# EAGLE design PSPS_AVNC_SRD_power-2021-02-03 (EAGLE 9.6.2)
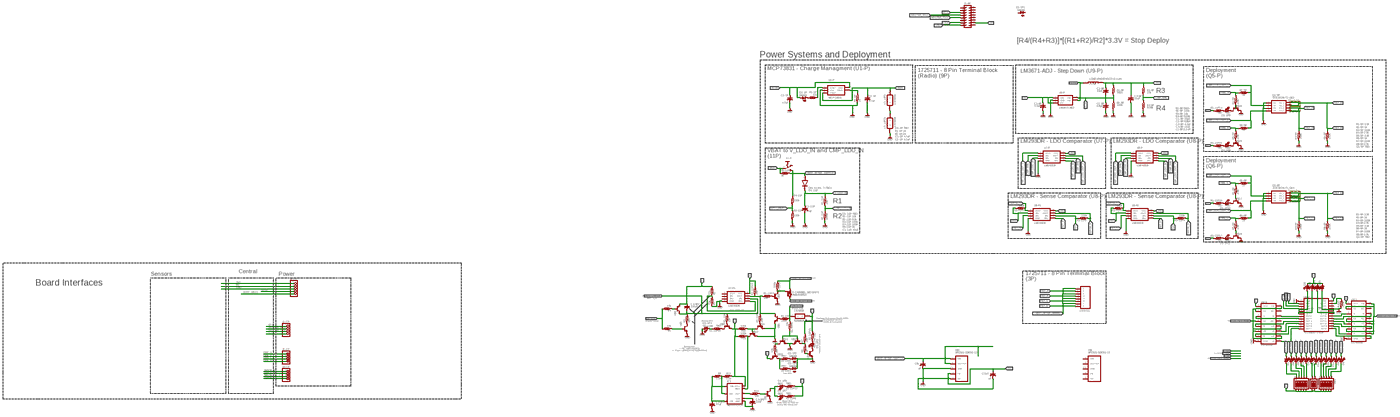
[diagram p0: schematic, sheet 1, overview]
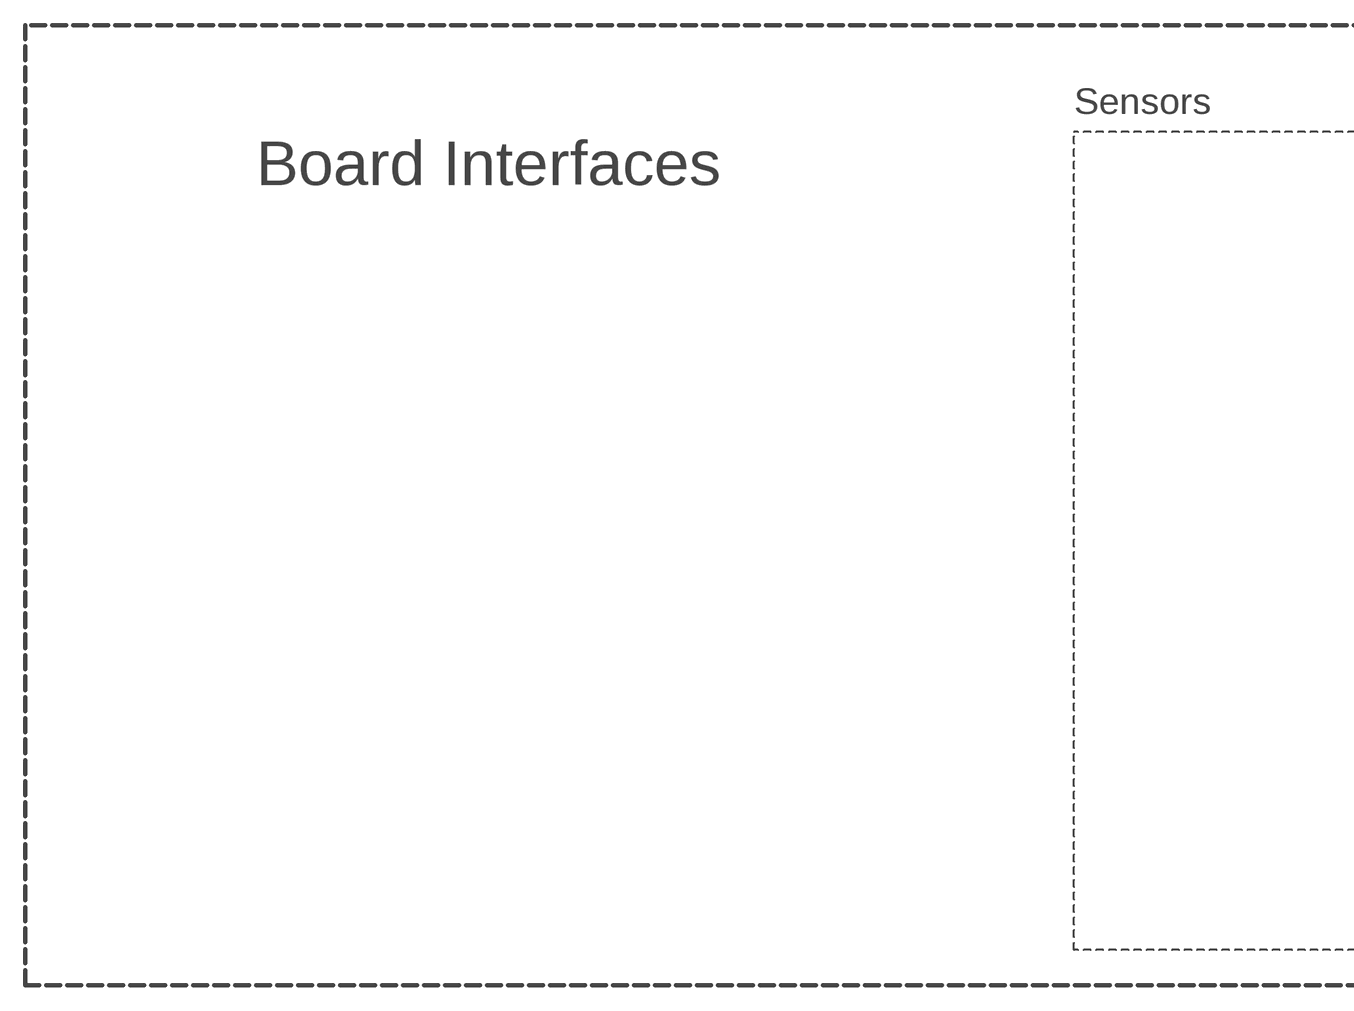
[diagram p1: schematic, sheet 1, part 1 of 4]
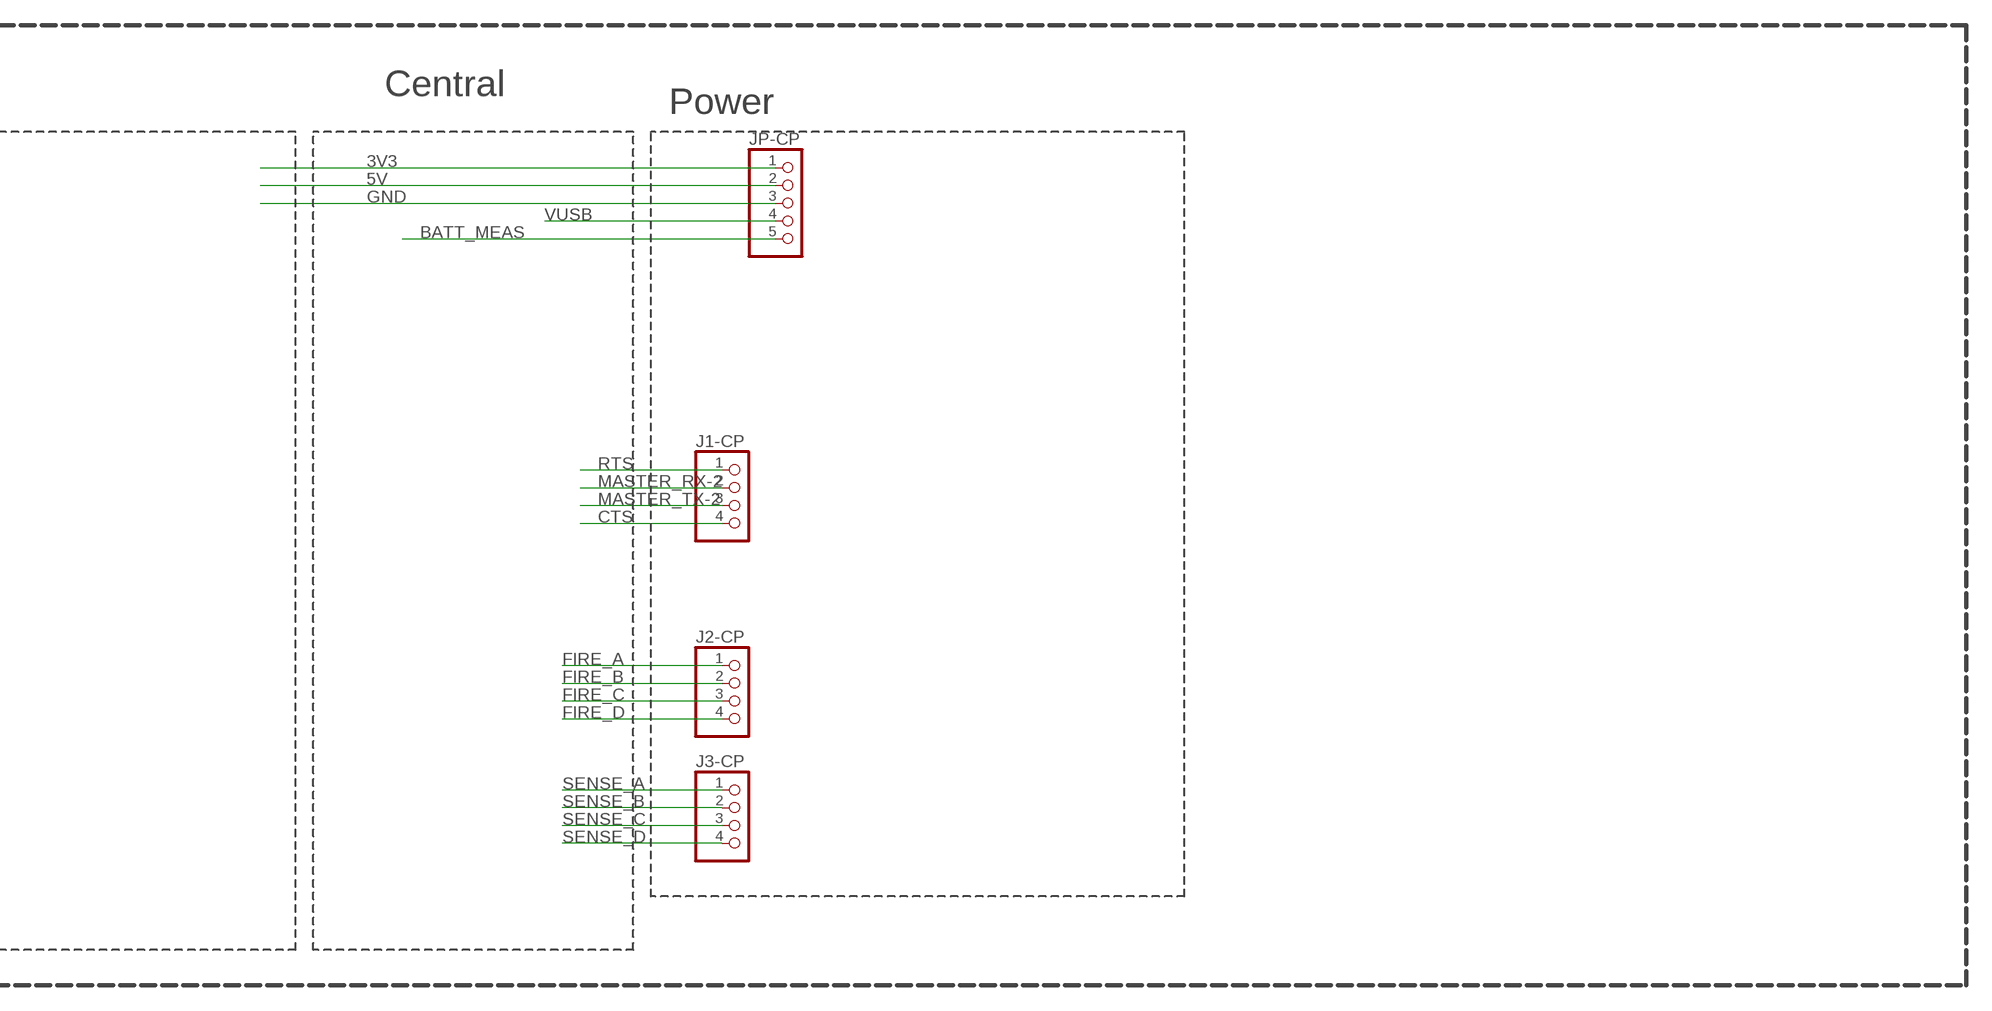
[diagram p2: schematic, sheet 1, part 2 of 4]
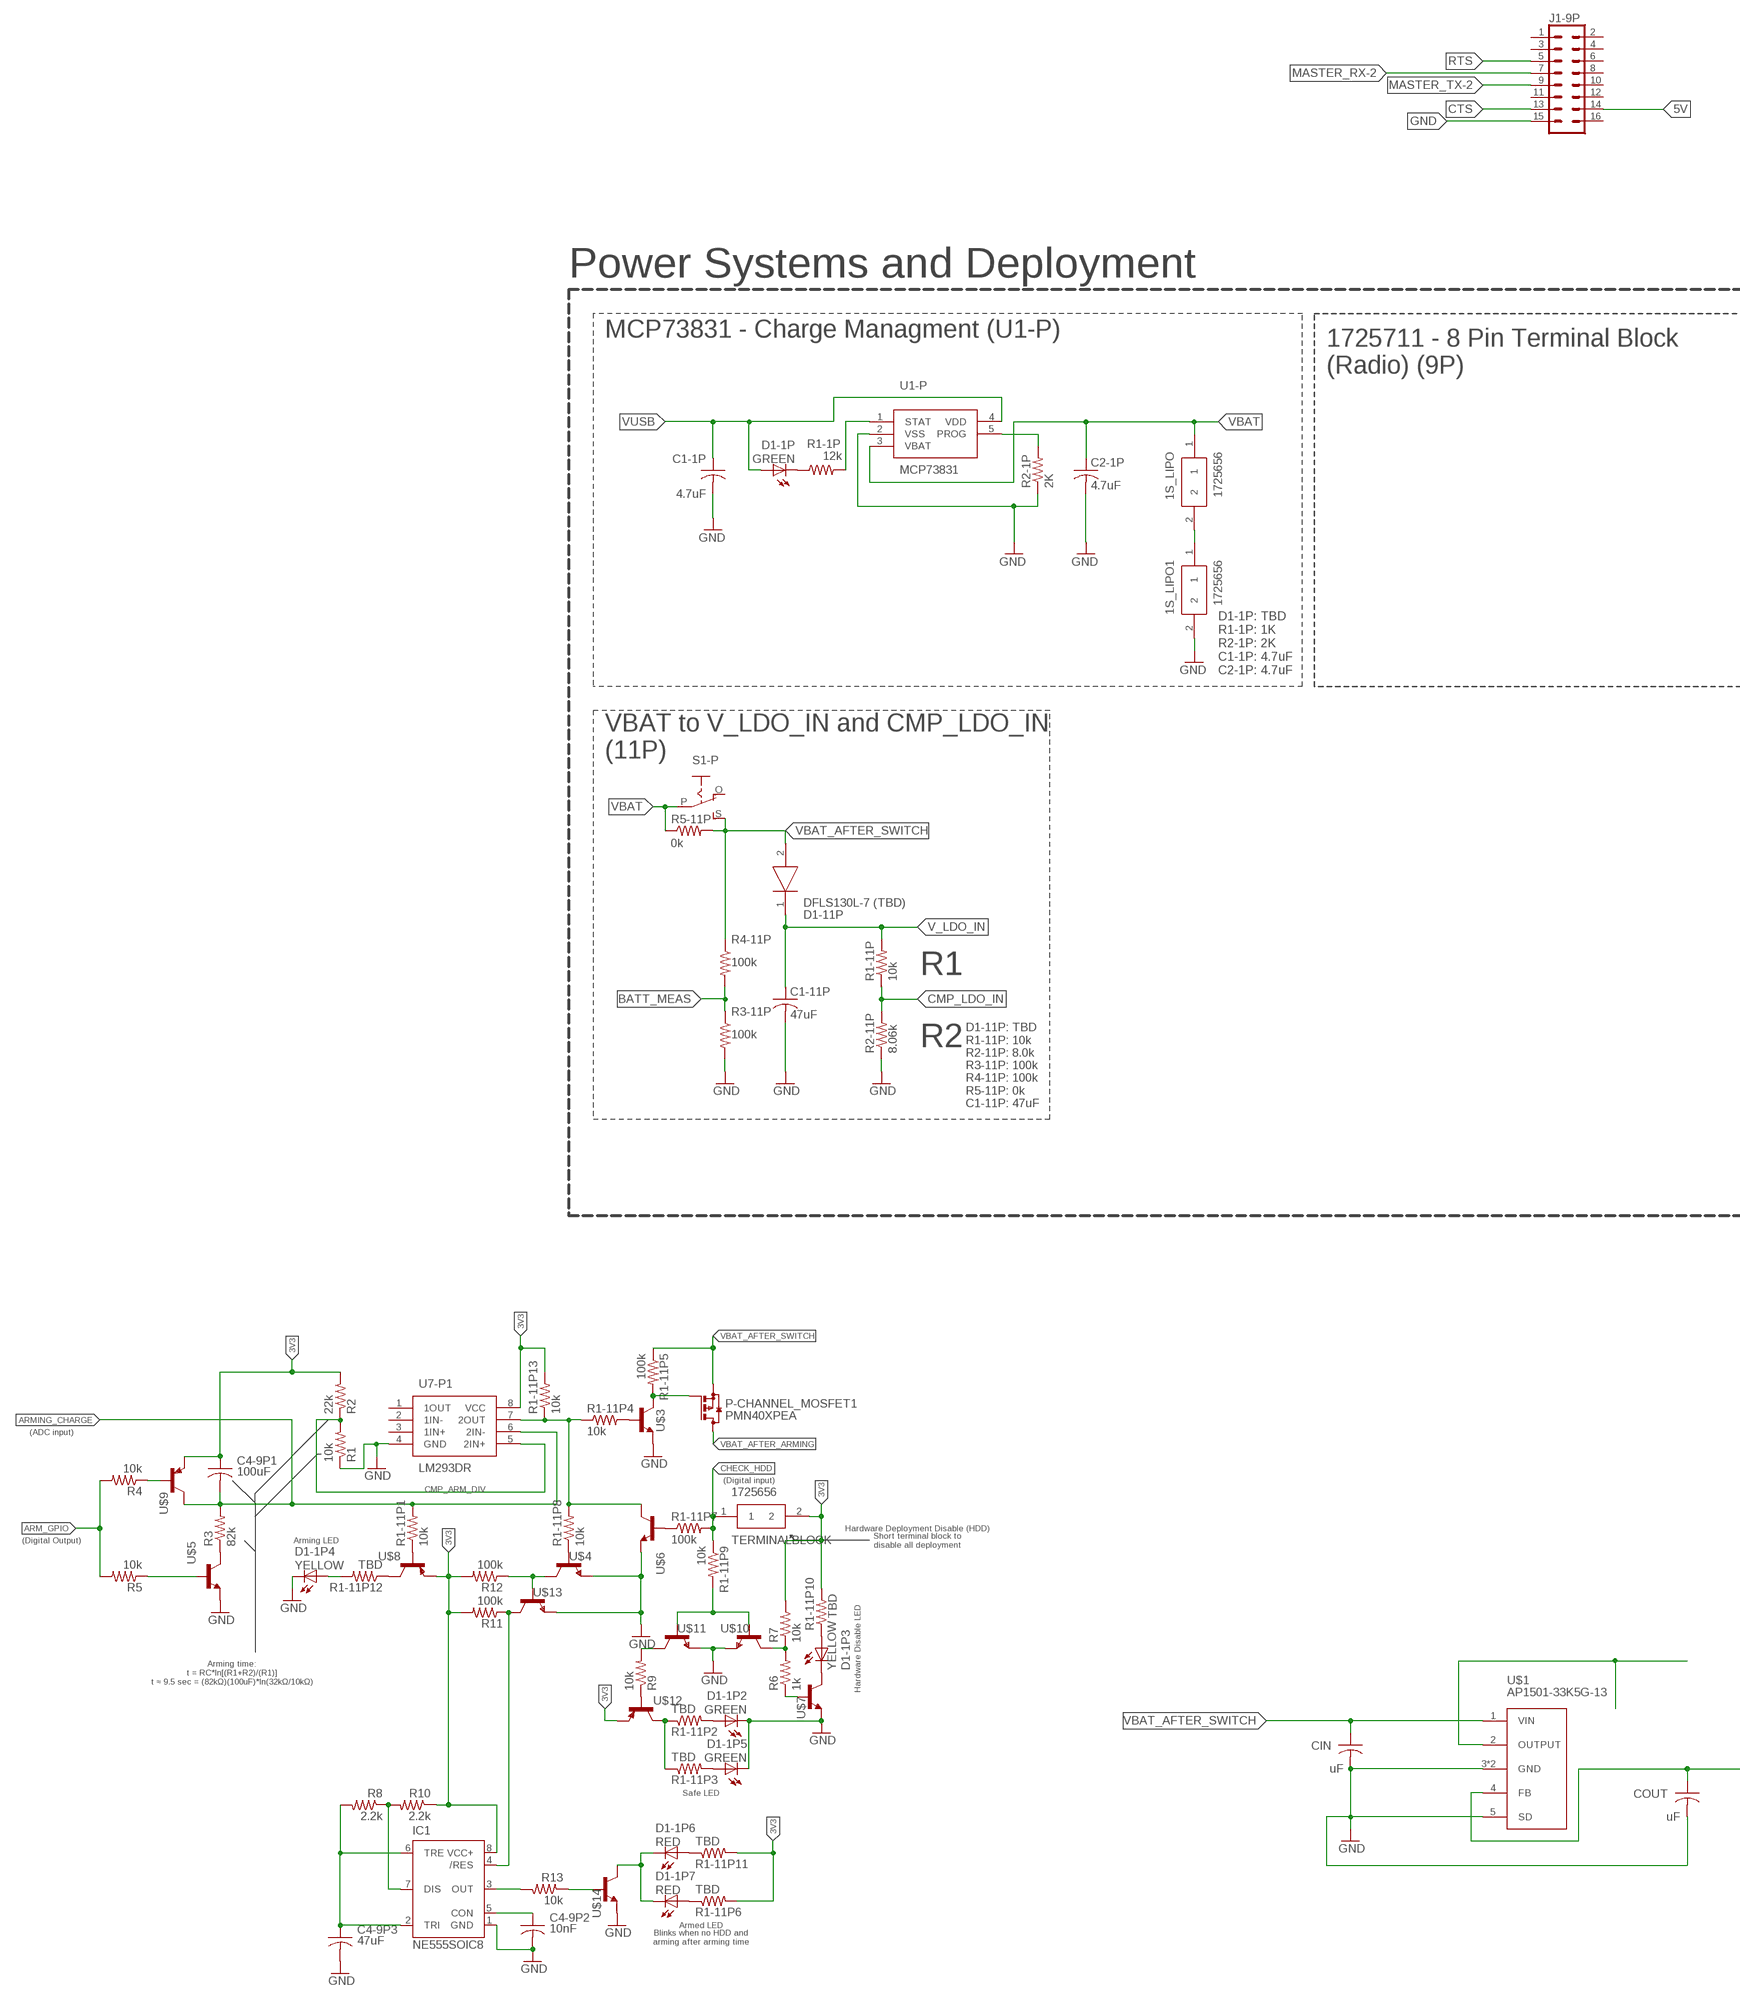
[diagram p3: schematic, sheet 1, part 3 of 4]
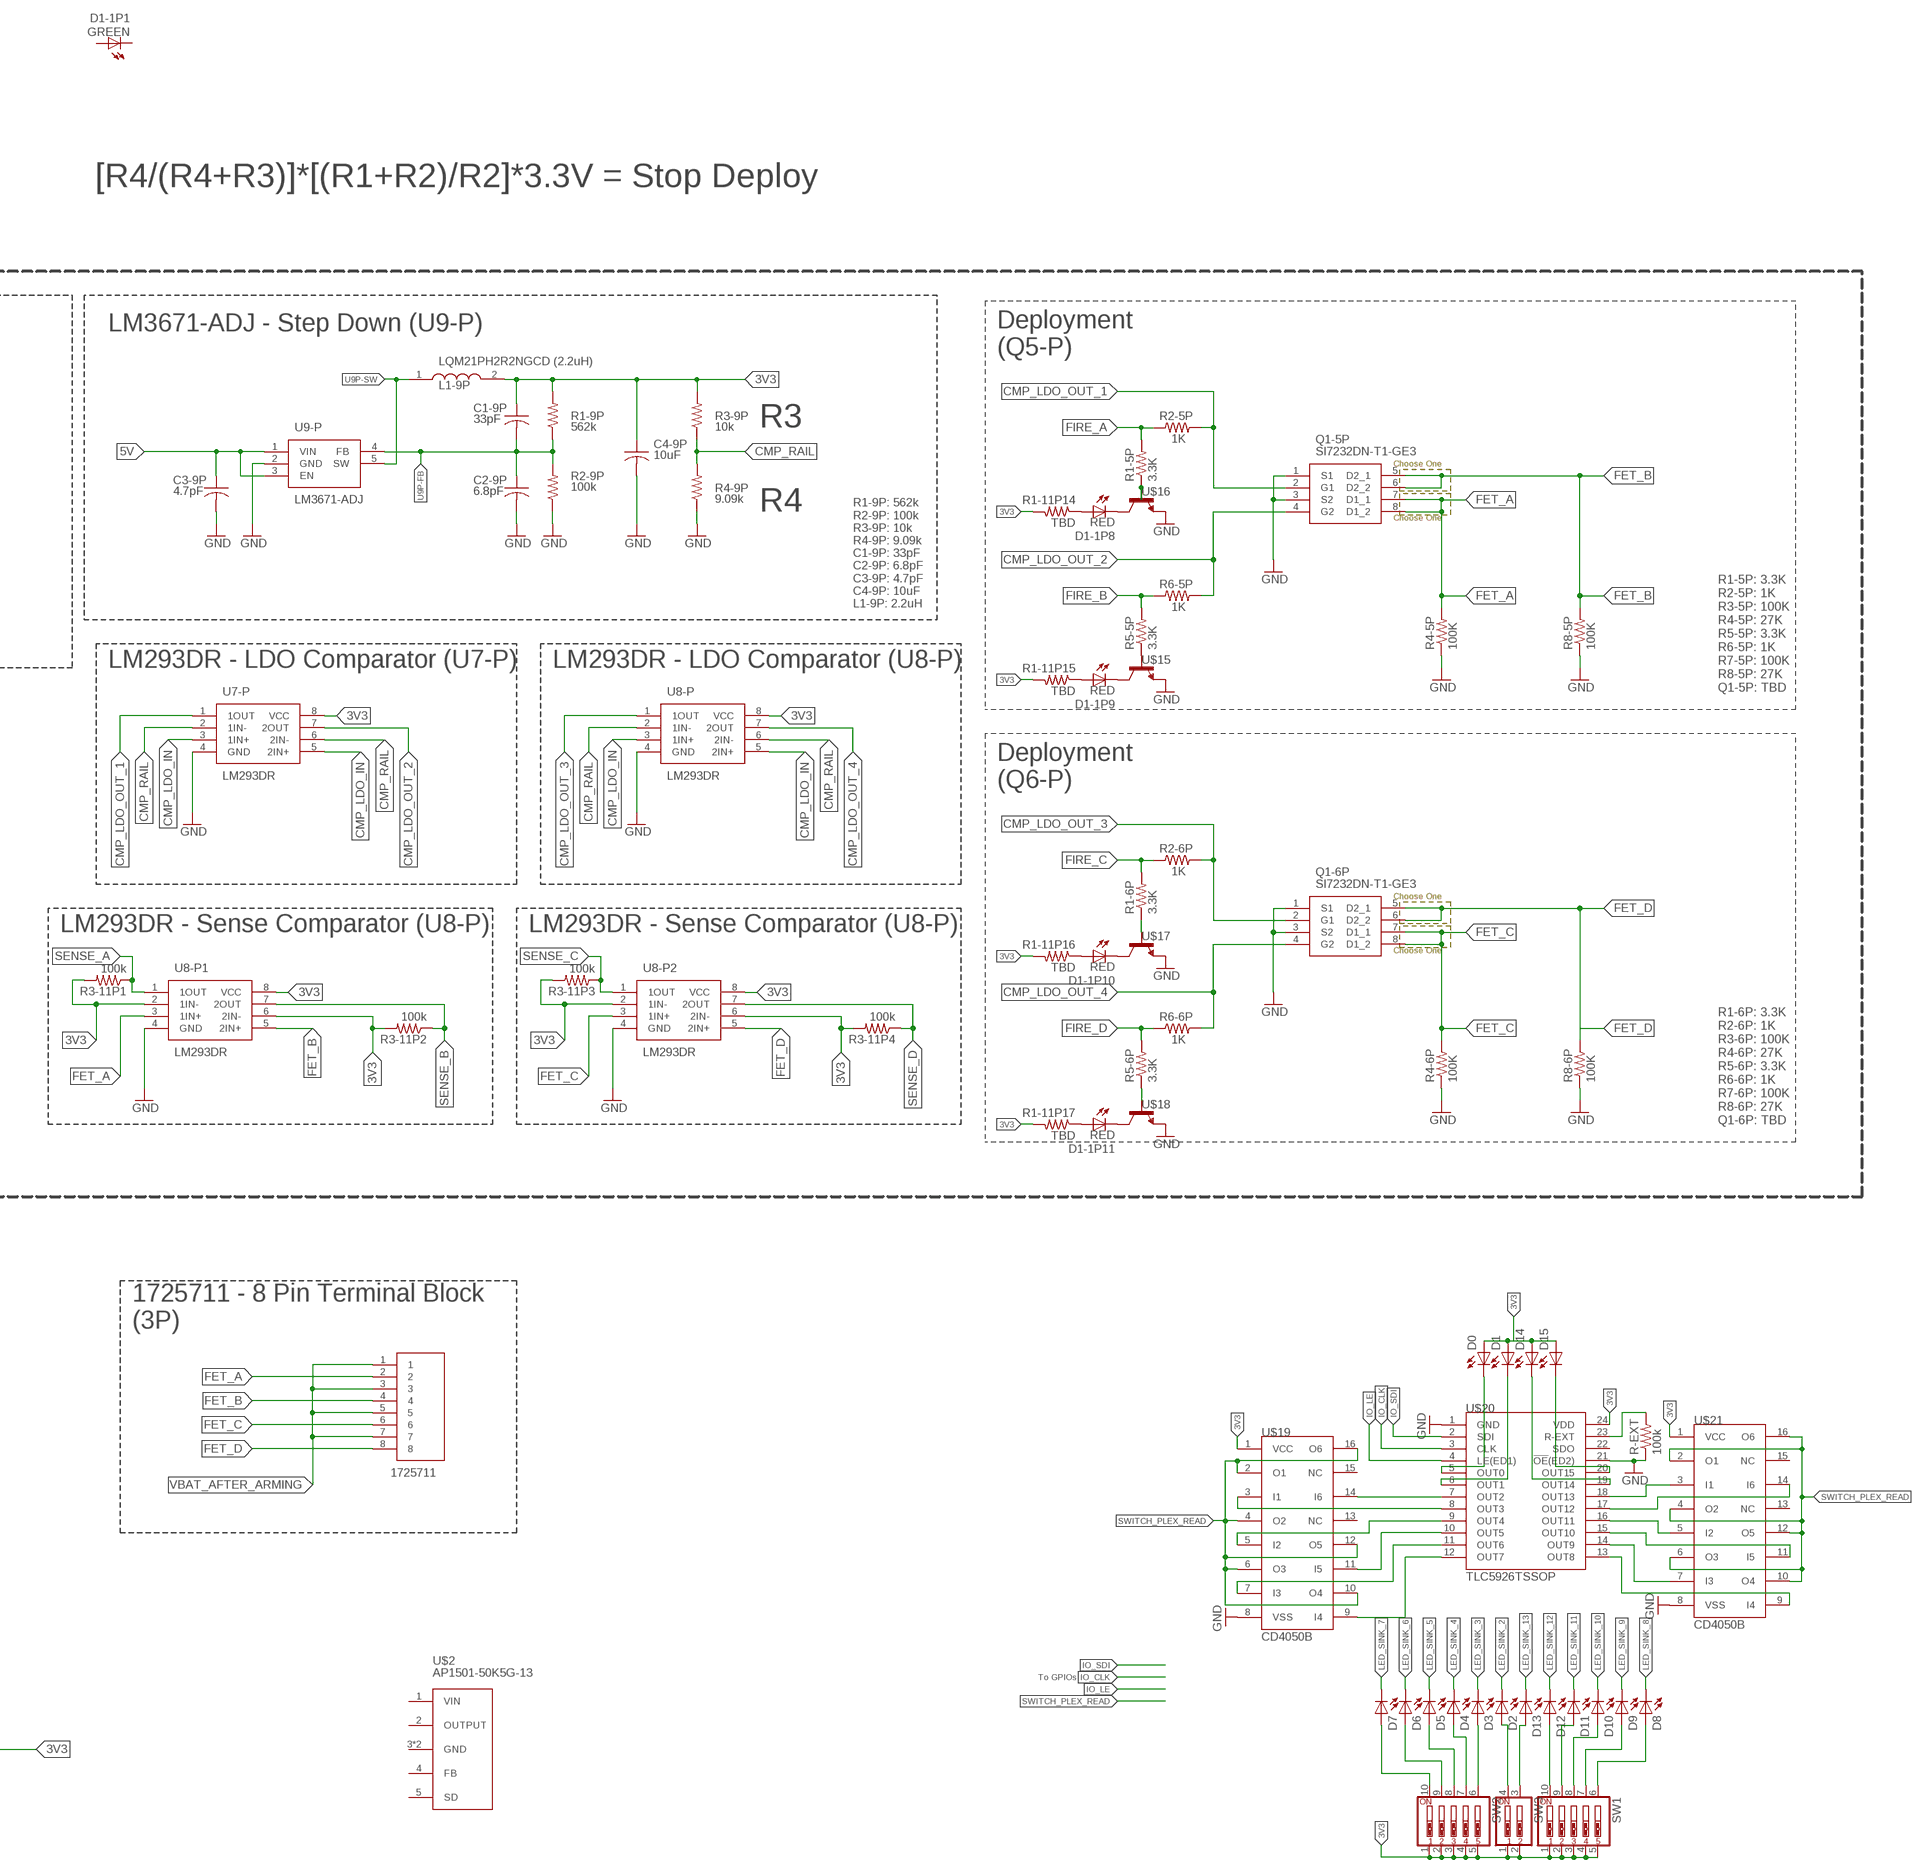
[diagram p4: schematic, sheet 1, part 4 of 4]

## Parts
1S_LIPO  1725656  [1725656]
1S_LIPO1  1725656  [1725656]
C1-1P  4.7uF  C-USC0805  [C0805]
C1-9P  33pF  C-USC0805  [C0805]
C1-11P  47uF  C-USC0805  [C0805]
C2-1P  4.7uF  C-USC0805  [C0805]
C2-9P  6.8pF  C-USC0805  [C0805]
C3-9P  4.7pF  C-USC0805  [C0805]
C4-9P  10uF  C-USC0805  [C0805]
C4-9P1  100uF  C-USC0805  [C0805]
C4-9P2  10nF  C-USC0805  [C0805]
C4-9P3  47uF  C-USC0805  [C0805]
CIN  uF  C-USC0805  [C0805]
COUT  uF  C-USC0805  [C0805]
D0  LEDCHIPLED_0805  [CHIPLED_0805]
D1  LEDCHIPLED_0805  [CHIPLED_0805]
D1-1P  GREEN  LEDCHIPLED_0805  [CHIPLED_0805]
D1-1P1  GREEN  LEDCHIPLED_0805  [CHIPLED_0805]
D1-1P2  GREEN  LEDCHIPLED_0805  [CHIPLED_0805]
D1-1P3  YELLOW  LEDCHIPLED_0805  [CHIPLED_0805]
D1-1P4  YELLOW  LEDCHIPLED_0805  [CHIPLED_0805]
D1-1P5  GREEN  LEDCHIPLED_0805  [CHIPLED_0805]
D1-1P6  RED  LEDCHIPLED_0805  [CHIPLED_0805]
D1-1P7  RED  LEDCHIPLED_0805  [CHIPLED_0805]
D1-1P8  RED  LEDCHIPLED_0805  [CHIPLED_0805]
D1-1P9  RED  LEDCHIPLED_0805  [CHIPLED_0805]
D1-1P10  RED  LEDCHIPLED_0805  [CHIPLED_0805]
D1-1P11  RED  LEDCHIPLED_0805  [CHIPLED_0805]
D1-11P  DFLS130L-7 (TBD)  DFLS130L-7  [POWERDI_123]
D2  LEDCHIPLED_0805  [CHIPLED_0805]
D3  LEDCHIPLED_0805  [CHIPLED_0805]
D4  LEDCHIPLED_0805  [CHIPLED_0805]
D5  LEDCHIPLED_0805  [CHIPLED_0805]
D6  LEDCHIPLED_0805  [CHIPLED_0805]
D7  LEDCHIPLED_0805  [CHIPLED_0805]
D8  LEDCHIPLED_0805  [CHIPLED_0805]
D9  LEDCHIPLED_0805  [CHIPLED_0805]
D10  LEDCHIPLED_0805  [CHIPLED_0805]
D11  LEDCHIPLED_0805  [CHIPLED_0805]
D12  LEDCHIPLED_0805  [CHIPLED_0805]
D13  LEDCHIPLED_0805  [CHIPLED_0805]
D14  LEDCHIPLED_0805  [CHIPLED_0805]
D15  LEDCHIPLED_0805  [CHIPLED_0805]
IC1  NE555SOIC8  [SOIC127P599X175-8]
J1-9P  CONN_08X2  [2X8]
J1-CP  PINHD-1X4  [1X04]
J2-CP  PINHD-1X4  [1X04]
J2-P  1725711  [1725711]
J3-CP  PINHD-1X4  [1X04]
JP-CP  PINHD-1X5  [1X05]
L1-9P  LQM21PH2R2NGCD (2.2uH)  LQM21PH2R2NGCD  [INDC2012X100N]
P-CHANNEL_MOSFET1  PMN40XPEA  [PMN40XPEA]
Q1-5P  SI7232DN-T1-GE3  [POWERPAK-1212-8]
Q1-6P  SI7232DN-T1-GE3  [POWERPAK-1212-8]
R1  10k  R-US_R0805  [R0805]
R1-1P  12k  R-US_R0805  [R0805]
R1-5P  3.3K  R-US_M0805  [M0805]
R1-6P  3.3K  R-US_M0805  [M0805]
R1-9P  562k  R-US_R0805  [R0805]
R1-11P  10k  R-US_R0805  [R0805]
R1-11P1  10k  R-US_R0805  [R0805]
R1-11P2  TBD  R-US_R0805  [R0805]
R1-11P3  TBD  R-US_R0805  [R0805]
R1-11P4  10k  R-US_R0805  [R0805]
R1-11P5  100k  R-US_R0805  [R0805]
R1-11P6  TBD  R-US_R0805  [R0805]
R1-11P7  100k  R-US_R0805  [R0805]
R1-11P8  10k  R-US_R0805  [R0805]
R1-11P9  10k  R-US_R0805  [R0805]
R1-11P10  TBD  R-US_R0805  [R0805]
R1-11P11  TBD  R-US_R0805  [R0805]
R1-11P12  TBD  R-US_R0805  [R0805]
R1-11P13  10k  R-US_R0805  [R0805]
R1-11P14  TBD  R-US_R0805  [R0805]
R1-11P15  TBD  R-US_R0805  [R0805]
R1-11P16  TBD  R-US_R0805  [R0805]
R1-11P17  TBD  R-US_R0805  [R0805]
R2  22k  R-US_R0805  [R0805]
R2-1P  2K  R-US_R0805  [R0805]
R2-5P  1K  R-US_M0805  [M0805]
R2-6P  1K  R-US_M0805  [M0805]
R2-9P  100k  R-US_R0805  [R0805]
R2-11P  8.06k  R-US_R0805  [R0805]
R3  82k  R-US_R0805  [R0805]
R3-9P  10k  R-US_R0805  [R0805]
R3-11P  100k  R-US_R0805  [R0805]
R3-11P1  100k  R-US_R0805  [R0805]
R3-11P2  100k  R-US_R0805  [R0805]
R3-11P3  100k  R-US_R0805  [R0805]
R3-11P4  100k  R-US_R0805  [R0805]
R4  10k  R-US_R0805  [R0805]
R4-5P  100K  R-US_M0805  [M0805]
R4-6P  100K  R-US_M0805  [M0805]
R4-9P  9.09k  R-US_R0805  [R0805]
R4-11P  100k  R-US_R0805  [R0805]
R5  10k  R-US_R0805  [R0805]
R5-5P  3.3K  R-US_M0805  [M0805]
R5-6P  3.3K  R-US_M0805  [M0805]
R5-11P  0k  R-US_R0805  [R0805]
R6  1k  R-US_R0805  [R0805]
R6-5P  1K  R-US_M0805  [M0805]
R6-6P  1K  R-US_M0805  [M0805]
R7  10k  R-US_R0805  [R0805]
R8  2.2k  R-US_R0805  [R0805]
R8-5P  100K  R-US_M0805  [M0805]
R8-6P  100K  R-US_M0805  [M0805]
R9  10k  R-US_R0805  [R0805]
R10  2.2k  R-US_R0805  [R0805]
R11  100k  R-US_R0805  [R0805]
R12  100k  R-US_R0805  [R0805]
R13  10k  R-US_R0805  [R0805]
R-EXT  100k  R-US_R0805  [R0805]
S1-P  EG1218S  [EG1218]
SW1  SW_DIP-5  [EDG-05]
SW2  SW_DIP-5  [EDG-05]
SW3  SW_DIP-2  [EDG-02]
TERMINALBLOCK  1725656  [1725656]
U1-P  MCP73831  MCP73831T-2ACI_OT  [SOT95P270X145-5N]
U7-P  LM293DR  [SOIC127P600X175-8N]
U7-P1  LM293DR  [SOIC127P600X175-8N]
U8-P  LM293DR  [SOIC127P600X175-8N]
U8-P1  LM293DR  [SOIC127P600X175-8N]
U8-P2  LM293DR  [SOIC127P600X175-8N]
U9-P  LM3671-ADJ  LM3671MFX-ADJ_NOPB  [SOT95P280X145-5N]
U$1  AP1501-33K5G-13  AP1501-33K5G-13TO263-5L  [TO185P1524X485-6N]
U$2  AP1501-50K5G-13  AP1501-33K5G-13TO263-5L  [TO185P1524X485-6N]
U$3  NPN_TRANSISTOR  [SOT23]
U$4  NPN_TRANSISTOR  [SOT23]
U$5  NPN_TRANSISTOR  [SOT23]
U$6  NPN_TRANSISTOR  [SOT23]
U$7  NPN_TRANSISTOR  [SOT23]
U$8  PNP_TRANSISTOR  [SOT23]
U$9  PNP_TRANSISTOR  [SOT23]
U$10  NPN_TRANSISTOR  [SOT23]
U$11  NPN_TRANSISTOR  [SOT23]
U$12  PNP_TRANSISTOR  [SOT23]
U$13  NPN_TRANSISTOR  [SOT23]
U$14  NPN_TRANSISTOR  [SOT23]
U$15  NPN_TRANSISTOR  [SOT23]
U$16  NPN_TRANSISTOR  [SOT23]
U$17  NPN_TRANSISTOR  [SOT23]
U$18  NPN_TRANSISTOR  [SOT23]
U$19  CD4050B  [SOIC127P600X175-16N]
U$20  TLC5926TSSOP  [SOP65P640X120-24N]
U$21  CD4050B  [SOIC127P600X175-16N]

## Nets
3V3: C1-9P.1 C4-9P1.1 C4-9P.1 COUT.1 D0.A D1.A D14.A D15.A IC1.8(VCC+) JP-CP.1 L1-9P.2 R1-9P.2 R1-11P6.2 R1-11P10.2 R1-11P11.2 R1-11P13.2 R1-11P14.2 R1-11P15.2 R1-11P16.2 R1-11P17.2 R2.2 R3-9P.2 R3-11P1.2 R3-11P2.2 R3-11P3.2 R3-11P4.2 R7.2 R10.1 R11.2 R12.2 SW1.1 SW1.2 SW1.3 SW1.4 SW1.5 SW2.1 SW2.2 SW2.3 SW2.4 SW2.5 SW3.1 SW3.2 TERMINALBLOCK.2 U7-P1.8(VCC) U7-P.8(VCC) U8-P1.2(1IN-) U8-P1.6(2IN-) U8-P1.8(VCC) U8-P2.2(1IN-) U8-P2.6(2IN-) U8-P2.8(VCC) U8-P.8(VCC) U$1.4(FB) U$8.2(E) U$9.2(E) U$12.2(E) U$19.1(VCC) U$20.24(VDD) U$21.1(VCC)
5V: C3-9P.1 J1-9P.14 JP-CP.2 U9-P.1(VIN) U9-P.3(EN)
ARM_GPIO: R4.2 R5.2
ARMING_CHARGE: C4-9P1.2 R1-11P1.2 R3.2 U7-P1.6(2IN-) U$9.3(C)
BATT_MEAS: JP-CP.5 R3-11P.1 R4-11P.2
CHECK_HDD: R1-11P7.2 R1-11P9.1 TERMINALBLOCK.1
CMP_ARM_DIV: R1.2 R2.1 U7-P1.5(2IN+)
CMP_LDO_IN: R1-11P.1 R2-11P.2 U7-P.3(1IN+) U7-P.5(2IN+) U8-P.3(1IN+) U8-P.5(2IN+)
CMP_LDO_OUT_1: Q1-5P.2(G1) R2-5P.2 U7-P.1(1OUT)
CMP_LDO_OUT_2: Q1-5P.4(G2) R6-5P.2 U7-P.7(2OUT)
CMP_LDO_OUT_3: Q1-6P.2(G1) R2-6P.2 U8-P.1(1OUT)
CMP_LDO_OUT_4: Q1-6P.4(G2) R6-6P.2 U8-P.7(2OUT)
CMP_RAIL: R3-9P.1 R4-9P.2 U7-P.2(1IN-) U7-P.6(2IN-) U8-P.2(1IN-) U8-P.6(2IN-)
CTS: J1-9P.13 J1-CP.4
D1-1P_R1-1P: D1-1P.C R1-1P.1
FET_A: J2-P.2 Q1-5P.7(D1_1) Q1-5P.8(D1_2) R4-5P.2 U8-P1.3(1IN+)
FET_B: J2-P.4 Q1-5P.5(D2_1) Q1-5P.6(D2_2) R8-5P.2 U8-P1.5(2IN+)
FET_C: J2-P.6 Q1-6P.7(D1_1) Q1-6P.8(D1_2) R4-6P.2 U8-P2.3(1IN+)
FET_D: J2-P.8 Q1-6P.5(D2_1) Q1-6P.6(D2_2) R8-6P.2 U8-P2.5(2IN+)
FIRE_A: J2-CP.1 R1-5P.2 R2-5P.1
FIRE_B: J2-CP.2 R5-5P.2 R6-5P.1
FIRE_C: J2-CP.3 R1-6P.2 R2-6P.1
FIRE_D: J2-CP.4 R5-6P.2 R6-6P.1
GND: 1S_LIPO1.2 C1-1P.2 C1-11P.2 C2-1P.2 C2-9P.2 C3-9P.2 C4-9P2.2 C4-9P3.2 C4-9P.2 CIN.2 COUT.2 D1-1P2.C D1-1P4.C D1-1P5.C IC1.1(GND) J1-9P.15 JP-CP.3 Q1-5P.1(S1) Q1-5P.3(S2) Q1-6P.1(S1) Q1-6P.3(S2) R1.1 R2-1P.1 R2-9P.1 R2-11P.1 R3-11P.2 R4-5P.1 R4-6P.1 R4-9P.1 R8-5P.1 R8-6P.1 R-EXT.1 U1-P.2(VSS) U7-P1.4(GND) U7-P.4(GND) U8-P1.4(GND) U8-P2.4(GND) U8-P.4(GND) U9-P.2(GND) U$1.3(GND) U$1.5(SD) U$1.6(GND) U$3.3(E) U$4.3(E) U$5.3(E) U$6.3(E) U$7.3(E) U$10.3(E) U$11.3(E) U$13.3(E) U$14.3(E) U$15.3(E) U$16.3(E) U$17.3(E) U$18.3(E) U$19.8(VSS) U$20.1(GND) U$20.21(!OE!(ED2)) U$21.8(VSS)
IO_CLK: U$20.3(CLK)
IO_LE: U$20.4(LE(ED1))
IO_SDI: U$20.2(SDI)
LED_SINK_0: D0.C U$20.5(OUT0)
LED_SINK_1: D1.C U$20.6(OUT1)
LED_SINK_2: D2.C U$19.14(I6) U$20.7(OUT2)
LED_SINK_3: D3.C U$19.3(I1) U$20.8(OUT3)
LED_SINK_4: D4.C U$19.5(I2) U$20.9(OUT4)
LED_SINK_5: D5.C U$19.11(I5) U$20.10(OUT5)
LED_SINK_6: D6.C U$19.7(I3) U$20.11(OUT6)
LED_SINK_7: D7.C U$19.9(I4) U$20.12(OUT7)
LED_SINK_8: D8.C U$20.13(OUT8) U$21.9(I4)
LED_SINK_9: D9.C U$20.14(OUT9) U$21.7(I3)
LED_SINK_10: D10.C U$20.15(OUT10) U$21.11(I5)
LED_SINK_11: D11.C U$20.16(OUT11) U$21.5(I2)
LED_SINK_12: D12.C U$20.17(OUT12) U$21.14(I6)
LED_SINK_13: D13.C U$20.18(OUT13) U$21.3(I1)
LED_SINK_14: D14.C U$20.19(OUT14)
LED_SINK_15: D15.C U$20.20(OUT15)
MASTER_RX-2: J1-9P.7 J1-CP.2
MASTER_TX-2: J1-9P.9 J1-CP.3
N$7: 1S_LIPO1.1 1S_LIPO.2
N$8: U$1.2(OUTPUT)
N$9: R1-11P8.1 U$4.1(B)
N$10: R1-11P1.1 U$8.1(B)
N$11: D1-1P3.C U$7.2(C)
N$12: R6.2 R7.1 U$10.2(C)
N$13: R6.1 U$7.1(B)
N$14: P-CHANNEL_MOSFET1.3(G) R1-11P5.2 U$3.2(C)
N$15: R1-11P4.2 U$3.1(B)
N$16: R1-11P4.1 R1-11P8.2 R1-11P13.1 U7-P1.7(2OUT) U$6.2(C)
N$17: R5.1 U$5.1(B)
N$18: R1-11P7.1 U$6.1(B)
N$19: R1-11P2.1 R1-11P3.1 U$12.3(C)
N$20: R1-11P9.2 U$10.1(B) U$11.1(B)
N$21: R3.1 U$5.2(C)
N$22: D1-1P2.A R1-11P2.2
N$23: D1-1P3.A R1-11P10.1
N$24: R12.1 U$4.2(C) U$13.1(B)
N$25: D1-1P6.A R1-11P11.1
N$26: R9.1 U$12.1(B)
N$27: R1-11P12.1 U$8.3(C)
N$28: D1-1P4.A R1-11P12.2
N$29: R9.2 U$11.2(C)
N$30: R4.1 U$9.1(B)
N$31: D1-1P5.A R1-11P3.2
N$32: IC1.4(/RES) R11.1 U$13.2(C)
N$33: R13.1 U$14.1(B)
N$34: C4-9P2.1 IC1.5(CON)
N$35: C4-9P3.1 IC1.2(TRI) IC1.6(TRE) R8.2
N$36: IC1.7(DIS) R8.1 R10.2
N$37: IC1.3(OUT) R13.2
N$38: D1-1P7.A R1-11P6.1
N$39: D1-1P6.C D1-1P7.C U$14.2(C)
N$40: R5-5P.1 U$15.1(B)
N$41: D1-1P8.C U$16.2(C)
N$42: D1-1P9.A R1-11P15.1
N$43: D1-1P9.C U$15.2(C)
N$44: D1-1P8.A R1-11P14.1
N$45: R1-5P.1 U$16.1(B)
N$46: R1-6P.1 U$17.1(B)
N$47: R5-6P.1 U$18.1(B)
N$48: D1-1P10.C U$17.2(C)
N$49: D1-1P10.A R1-11P16.1
N$50: D1-1P11.C U$18.2(C)
N$51: D1-1P11.A R1-11P17.1
N$52: D7.A SW2.10
N$53: R-EXT.2 U$20.23(R-EXT)
N$54: D3.A SW2.6
N$55: D4.A SW2.7
N$56: D5.A SW2.8
N$57: D6.A SW2.9
N$58: D2.A SW3.4
N$59: D12.A SW1.10
N$61: D11.A SW1.9
N$62: D10.A SW1.8
N$64: D9.A SW1.7
N$65: D8.A SW1.6
N$66: D13.A SW3.3
RTS: J1-9P.5 J1-CP.1
SENSE_A: J3-CP.1 R3-11P1.1 U8-P1.1(1OUT)
SENSE_B: J3-CP.2 R3-11P2.1 U8-P1.7(2OUT)
SENSE_C: J3-CP.3 R3-11P3.1 U8-P2.1(1OUT)
SENSE_D: J3-CP.4 R3-11P4.1 U8-P2.7(2OUT)
SWITCH_PLEX_READ: U$19.2(O1) U$19.4(O2) U$19.6(O3) U$19.10(O4) U$19.12(O5) U$19.16(O6) U$21.2(O1) U$21.4(O2) U$21.6(O3) U$21.10(O4) U$21.12(O5) U$21.16(O6)
U1P-PROG: R2-1P.2 U1-P.5(PROG)
U1P-STAT: R1-1P.2 U1-P.1(STAT)
U9P-FB: C1-9P.2 C2-9P.1 R1-9P.1 R2-9P.2 U9-P.4(FB)
U9P-SW: L1-9P.1 U9-P.5(SW)
V_LDO_IN: C1-11P.1 D1-11P.1(K) R1-11P.2
VBAT: 1S_LIPO.1 C2-1P.1 R5-11P.1 S1-P.P U1-P.3(VBAT)
VBAT_AFTER_ARMING: J2-P.1 J2-P.3 J2-P.5 J2-P.7 P-CHANNEL_MOSFET1.1(D) P-CHANNEL_MOSFET1.2(D) P-CHANNEL_MOSFET1.5(D) P-CHANNEL_MOSFET1.6(D)
VBAT_AFTER_SWITCH: CIN.1 D1-11P.2(A) P-CHANNEL_MOSFET1.4(S) R1-11P5.1 R4-11P.1 R5-11P.2 S1-P.S U$1.1(VIN)
VUSB: C1-1P.1 D1-1P.A JP-CP.4 U1-P.4(VDD)
Unconnected: D1-1P1.A D1-1P1.C J1-9P.1 J1-9P.2 J1-9P.3 J1-9P.4 J1-9P.6 J1-9P.8 J1-9P.10 J1-9P.11 J1-9P.12 J1-9P.16 S1-P.O U7-P1.1(1OUT) U7-P1.2(1IN-) U7-P1.3(1IN+) U$2.1(VIN) U$2.2(OUTPUT) U$2.3(GND) U$2.4(FB) U$2.5(SD) U$2.6(GND) U$19.13(NC) U$19.15(NC) U$20.22(SDO) U$21.13(NC) U$21.15(NC)

## Notes on the sheet
- [R4/(R4+R3)]*[(R1+R2)/R2]*3.3V = Stop Deploy
- Power Systems and Deployment
- MCP73831 - Charge Managment (U1-P)
- LM3671-ADJ - Step Down (U9-P)
- 1725711 - 8 Pin Terminal Block 
  (Radio) (9P)
- Deployment
  (Q5-P)
- R3
- Choose One
- R4
- Choose One
- R1-9P: 562k
  R2-9P: 100k
  R3-9P: 10k
  R4-9P: 9.09k
  C1-9P: 33pF
  C2-9P: 6.8pF
  C3-9P: 4.7pF
  C4-9P: 10uF
  L1-9P: 2.2uH
- D1-1P: TBD
  R1-1P: 1K
  R2-1P: 2K
  C1-1P: 4.7uF
  C2-1P: 4.7uF
- LM293DR - LDO Comparator (U7-P) | LM293DR - LDO Comparator (U8-P)
- R1-5P: 3.3K
  R2-5P: 1K
  R3-5P: 100K
  R4-5P: 27K
  R5-5P: 3.3K
  R6-5P: 1K
  R7-5P: 100K
  R8-5P: 27K
  Q1-5P: TBD
- VBAT to V_LDO_IN and CMP_LDO_IN
  (11P)
- Deployment
  (Q6-P)
- Choose One
- LM293DR - Sense Comparator (U8-P) | LM293DR - Sense Comparator (U8-P)
- R1
- Choose One
- R2
- D1-11P: TBD
  R1-11P: 10k
  R2-11P: 8.0k
  R3-11P: 100k
  R4-11P: 100k
  R5-11P: 0k
  C1-11P: 47uF
- R1-6P: 3.3K
  R2-6P: 1K
  R3-6P: 100K
  R4-6P: 27K
  R5-6P: 3.3K
  R6-6P: 1K
  R7-6P: 100K
  R8-6P: 27K
  Q1-6P: TBD
- Central
- Sensors | Power
- 1725711 - 8 Pin Terminal Block
  (3P)
- Board Interfaces
- (ADC input)
- (Digital input)
- Hardware Deployment Disable (HDD)
- (Digital Output) | Arming LED
- Short terminal block to
  disable all deployment
- Hardware Disable LED
- Arming time:
  t = RC*ln[(R1+R2)/(R1)]
  t ≈ 9.5 sec = (82kΩ)(100uF)*ln(32kΩ/10kΩ)
- To GPIOs
- Safe LED
- Armed LED
- Blinks when no HDD and
  arming after arming time

## Library data of the parts
1S_LIPO 1S_LIPO1 TERMINALBLOCK = SamacSys_Parts:1725656: 2 way PCB vertical mount terminal,2.54mm 2 way PCB vertical mount terminal,2.54mm Source: Datasheet <https://componentsearchengine.com/Datasheets/1/1725656.pdf>; DESCRIPTION: 2 way PCB vertical mount terminal,2.54mm 2 way PCB vertical mount terminal,2.54mm; HEIGHT: 8mm; MANUFACTURER_NAME: Phoenix Contact; MANUFACTURER_PART_NUMBER: 1725656; MOUSER_PART_NUMBER: 651-1725656; MOUSER_PRICE-STOCK: https://www.mouser.com/Search/Refine.aspx?Keyword=651-1725656
C1-1P C1-9P C1-11P C2-1P C2-9P C3-9P C4-9P C4-9P1-C4-9P3 CIN COUT = resistor:C-US: CAPACITOR, American symbol
D0 D1 D1-1P D1-1P1-D1-1P11 D2-D15 = adafruit:LED: LED OSRAM: - CHIPLED LG R971, LG N971, LY N971, LG Q971, LY Q971, LO R971, LY R971 LH N974, LH R974 LS Q976, LO Q976, LY Q976 LO Q996 - Hyper CHIPLED LW Q18S LB Q993, LB Q99A, LB R99A - SideLED LS A670, LO A670, LY A670, LG A670, LP A670 LB A673, LV A673, LT A673, LW A673 LH A674 LY A675 LS A676, LA A676, LO A676, LY A676, LW A676 LS A679, LY A679, LG A679 - Hyper Micro SIDELED® LS Y876, LA Y876, LO Y876, LY Y876 LT Y87S - SmartLED LW L88C, LW L88S LB L89C, LB L89S, LG L890 LS L89K, LO L89K, LY L89K LS L896, LA L896, LO L896, LY L896 - TOPLED LS T670, LO T670, LY T670, LG T670, LP T670 LSG T670, LSP T670, LSY T670, LOP T670, LYG T670 LG T671, LOG T671, LSG T671 LB T673, LV T673, LT T673, LW T673 LH T674 LS T676, LA T676, LO T676, LY T676, LB T676, LH T676, LSB T676, LW T676 LB T67C, LV T67C, LT T67C, LS T67K, LO T67K, LY T67K, LW E67C LS E67B, LA E67B, LO E67B, LY E67B, LB E67C, LV E67C, LT E67C LW T67C LS T679, LY T679, LG T679 LS T770, LO T770, LY T770, LG T770, LP T770 LB T773, LV T773, LT T773, LW T773 LH T774 LS E675, LA E675, LY E675, LS T675 LS T776, LA T776, LO T776, LY T776, LB T776 LHGB T686 LT T68C, LB T68C - Hyper Mini TOPLED® LB M676 - Mini TOPLED Santana® LG M470 LS M47K, LO M47K, LY M47K Source: http://www.osram.convergy.de/
D1-11P = SamacSys_Parts:DFLS130L-7: 1.0A SURFACE MOUNT SCHOTTKY BARRIER RECTIFIER Source: Datasheet <https://componentsearchengine.com/Datasheets/1/DFLS130L-7.pdf>; DESCRIPTION: 1.0A SURFACE MOUNT SCHOTTKY BARRIER RECTIFIER; HEIGHT: mm; MANUFACTURER_NAME: Diodes Inc.; MANUFACTURER_PART_NUMBER: DFLS130L-7; MOUSER_PART_NUMBER: 621-DFLS130L; MOUSER_PRICE-STOCK: https://www.mouser.com/Search/Refine.aspx?Keyword=621-DFLS130L
IC1 = Flight Computer Parts:NE555: General purpose bipolar Timer
J1-9P = SparkFun-Connectors:CONN_08X2: Multi connection point. Often used as Generic Header-pin footprint for 0.1 inch spaced/style header connections You can populate with any combo of single row headers, but if you'd like an exact match, check this: Header - 2x8 (Male, 0.1") <https://www.sparkfun.com/products/13156> (PRT-13156) On any of the 0.1 inch spaced packages, you can populate with these: Break Away Headers - Straight <https://www.sparkfun.com/products/116> (PRT-00116) Break Away Male Headers - Right Angle <https://www.sparkfun.com/products/553> (PRT-00553) Female Headers <https://www.sparkfun.com/products/115> (PRT-00115) Break Away Headers - Machine Pin <https://www.sparkfun.com/products/117> (PRT-00117) Break Away Female Headers - Swiss Machine Pin <https://www.sparkfun.com/products/743> (PRT-00743)
J1-CP J2-CP J3-CP = pinhead:PINHD-1X4: PIN HEADER
J2-P = SamacSys_Parts:1725711: 8 way PCB vertical mount terminal,2.54mm 8 way PCB vertical mount terminal,2.54mm Source: Datasheet <https://componentsearchengine.com/Datasheets/1/1725711.pdf>; DESCRIPTION: 8 way PCB vertical mount terminal,2.54mm 8 way PCB vertical mount terminal,2.54mm; HEIGHT: mm; MANUFACTURER_NAME: Phoenix Contact; MANUFACTURER_PART_NUMBER: 1725711; MOUSER_PART_NUMBER: 651-1725711; MOUSER_PRICE-STOCK: https://www.mouser.com/Search/Refine.aspx?Keyword=651-1725711
JP-CP = pinhead:PINHD-1X5: PIN HEADER
L1-9P = SamacSys_Parts:LQM21PH2R2NGCD: LQM21PH_GC Series Inductor 2.2uH +/-30% 0805 (2012) Source: Datasheet <https://componentsearchengine.com/Datasheets/1/LQM21PH2R2NGCD.pdf>; DESCRIPTION: LQM21PH_GC Series Inductor 2.2uH +/-30% 0805 (2012); HEIGHT: 1mm; MANUFACTURER_NAME: Murata Electronics; MANUFACTURER_PART_NUMBER: LQM21PH2R2NGCD; MOUSER_PART_NUMBER: 81-LQM21PH2R2NGCD; MOUSER_PRICE-STOCK: https://www.mouser.com/Search/Refine.aspx?Keyword=81-LQM21PH2R2NGCD
P-CHANNEL_MOSFET1 = SamacSys_Parts:PMN40XPEA: https://www.mouser.com/datasheet/2/916/PMN40XPEA-1880110.pdf
Q1-5P Q1-6P = SamacSys_Parts:SI7232DN-T1-GE3: Trans MOSFET N-CH 20V 10An Vishay SI7232DN-T1-GE3 Dual N-channel MOSFET Transistor, 24 A, 20 V, 8-Pin PowerPAK 1212 Source: Datasheet <http://www.mouser.com/ds/2/427/si7232dn-279732.pdf>; ARROW_PART_NUMBER: SI7232DN-T1-GE3; ARROW_PRICE-STOCK: https://www.arrow.com/en/products/si7232dn-t1-ge3/vishay; DESCRIPTION: Trans MOSFET N-CH 20V 10An Vishay SI7232DN-T1-GE3 Dual N-channel MOSFET Transistor, 24 A, 20 V, 8-Pin PowerPAK 1212; HEIGHT: mm; MANUFACTURER_NAME: Vishay; MANUFACTURER_PART_NUMBER: SI7232DN-T1-GE3; MOUSER_PART_NUMBER: 781-SI7232DN-GE3; MOUSER_PRICE-STOCK: https://www.mouser.co.uk/ProductDetail/Vishay-Semiconductors/SI7232DN-T1-GE3?qs=%252BPu8jn5UVnH5FJ8Jo4EbFw%3D%3D
R1 R1-1P R1-9P R1-11P R1-11P1-R1-11P17 R2 R2-1P R2-9P R2-11P R3 R3-9P R4 R4-9P R5-R13 = resistor:R-US_: RESISTOR, American symbol
R1-5P R1-6P R2-5P R2-6P R4-5P R4-6P R5-5P R5-6P R6-5P R6-6P R8-5P R8-6P = rcl:R-US_: RESISTOR, American symbol; SPICEPREFIX: R
R3-11P R3-11P1-R3-11P4 R4-11P R5-11P R-EXT = PulseOximeterECG_AU:R-US_: RESISTOR, American symbol; SPICEPREFIX: R
S1-P = adafruit:EG1218: SLIDING SWITCH 0.1" spacing through hole, vertical SPDT slide switch http://www.ladyada.net/library/pcb/eaglelibrary.html
SW1 SW2 = special:SW_DIP-5: DIP SWITCH
SW3 = special:SW_DIP-2: DIP SWITCH
U1-P = SamacSys_Parts:MCP73831T-2ACI_OT: Li-Ion Charge Controller 4.2V SOT23-5 Source: Datasheet <http://ww1.microchip.com/downloads/en/DeviceDoc/20001984g.pdf>; DESCRIPTION: Li-Ion Charge Controller 4.2V SOT23-5; HEIGHT: 1.45mm; MANUFACTURER_NAME: Microchip; MANUFACTURER_PART_NUMBER: MCP73831T-2ACI/OT; MOUSER_PART_NUMBER: 579-MCP73831T-2ACIOT; MOUSER_PRICE-STOCK: https://www.mouser.co.uk/ProductDetail/Microchip-Technology/MCP73831T-2ACI-OT?qs=yUQqVecv4qvbBQBGbHx0Mw%3D%3D
U7-P U7-P1 U8-P U8-P1 U8-P2 = SamacSys_Parts:LM293DR: Dual differential comparator, industrial grade Source: Datasheet <http://www.ti.com/lit/gpn/lm293>; DESCRIPTION: Dual differential comparator, industrial grade; HEIGHT: 1.75mm; MANUFACTURER_NAME: Texas Instruments; MANUFACTURER_PART_NUMBER: LM293DR; MOUSER_PART_NUMBER: 595-LM293DR; MOUSER_PRICE-STOCK: https://www.mouser.com/Search/Refine.aspx?Keyword=595-LM293DR
U9-P = SamacSys_Parts:LM3671MFX-ADJ_NOPB: 2MHz, 600mA Step-Down DC-DC Converter Source: Datasheet <http://www.ti.com/lit/gpn/lm3671>; DESCRIPTION: 2MHz, 600mA Step-Down DC-DC Converter; HEIGHT: 1.45mm; MANUFACTURER_NAME: Texas Instruments; MANUFACTURER_PART_NUMBER: LM3671MFX-ADJ/NOPB; MOUSER_PART_NUMBER: 926-LM3671MFXADJNOPB; MOUSER_PRICE-STOCK: https://www.mouser.com/Search/Refine.aspx?Keyword=926-LM3671MFXADJNOPB
U$1 U$2 = SamacSys_Parts:AP1501-33K5G-13
U$3-U$7 U$10 U$11 U$13-U$18 = Flight Computer Parts:NPN_TRANSISTOR
U$8 U$9 U$12 = Flight Computer Parts:PNP_TRANSISTOR
U$19 U$21 = Computer2:CD4050B
U$20 = Custom:TLC5926

## Board
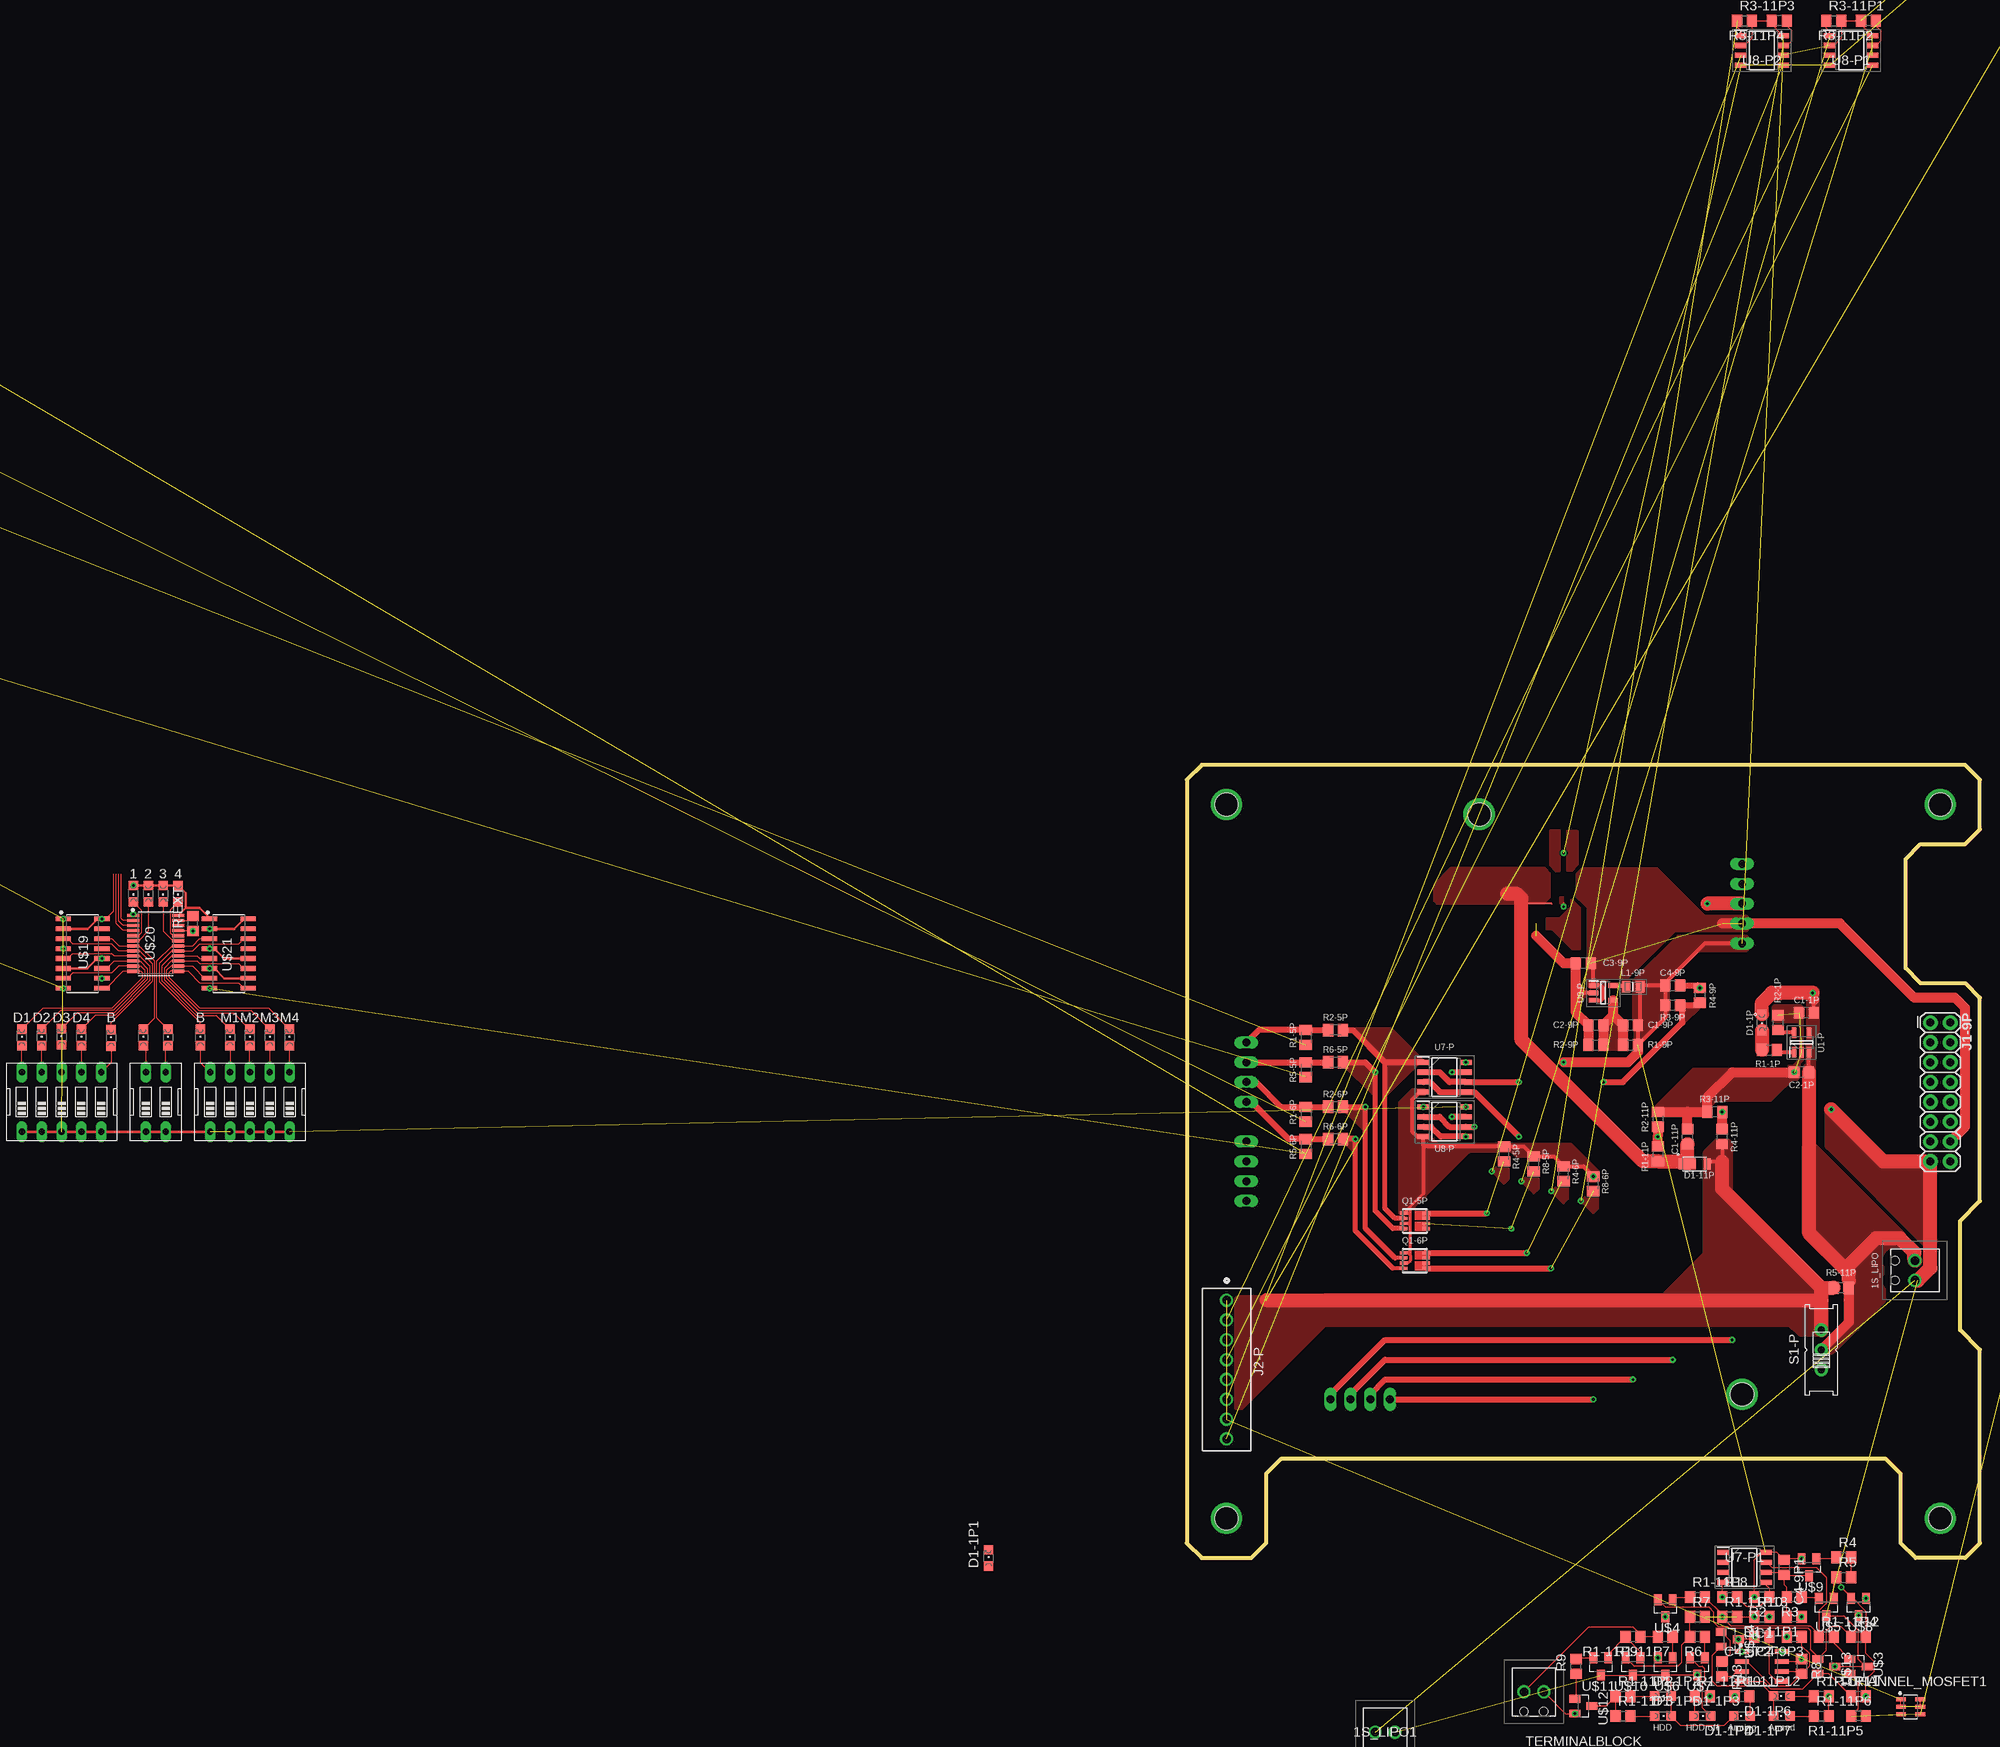
[diagram p5: board, top side]
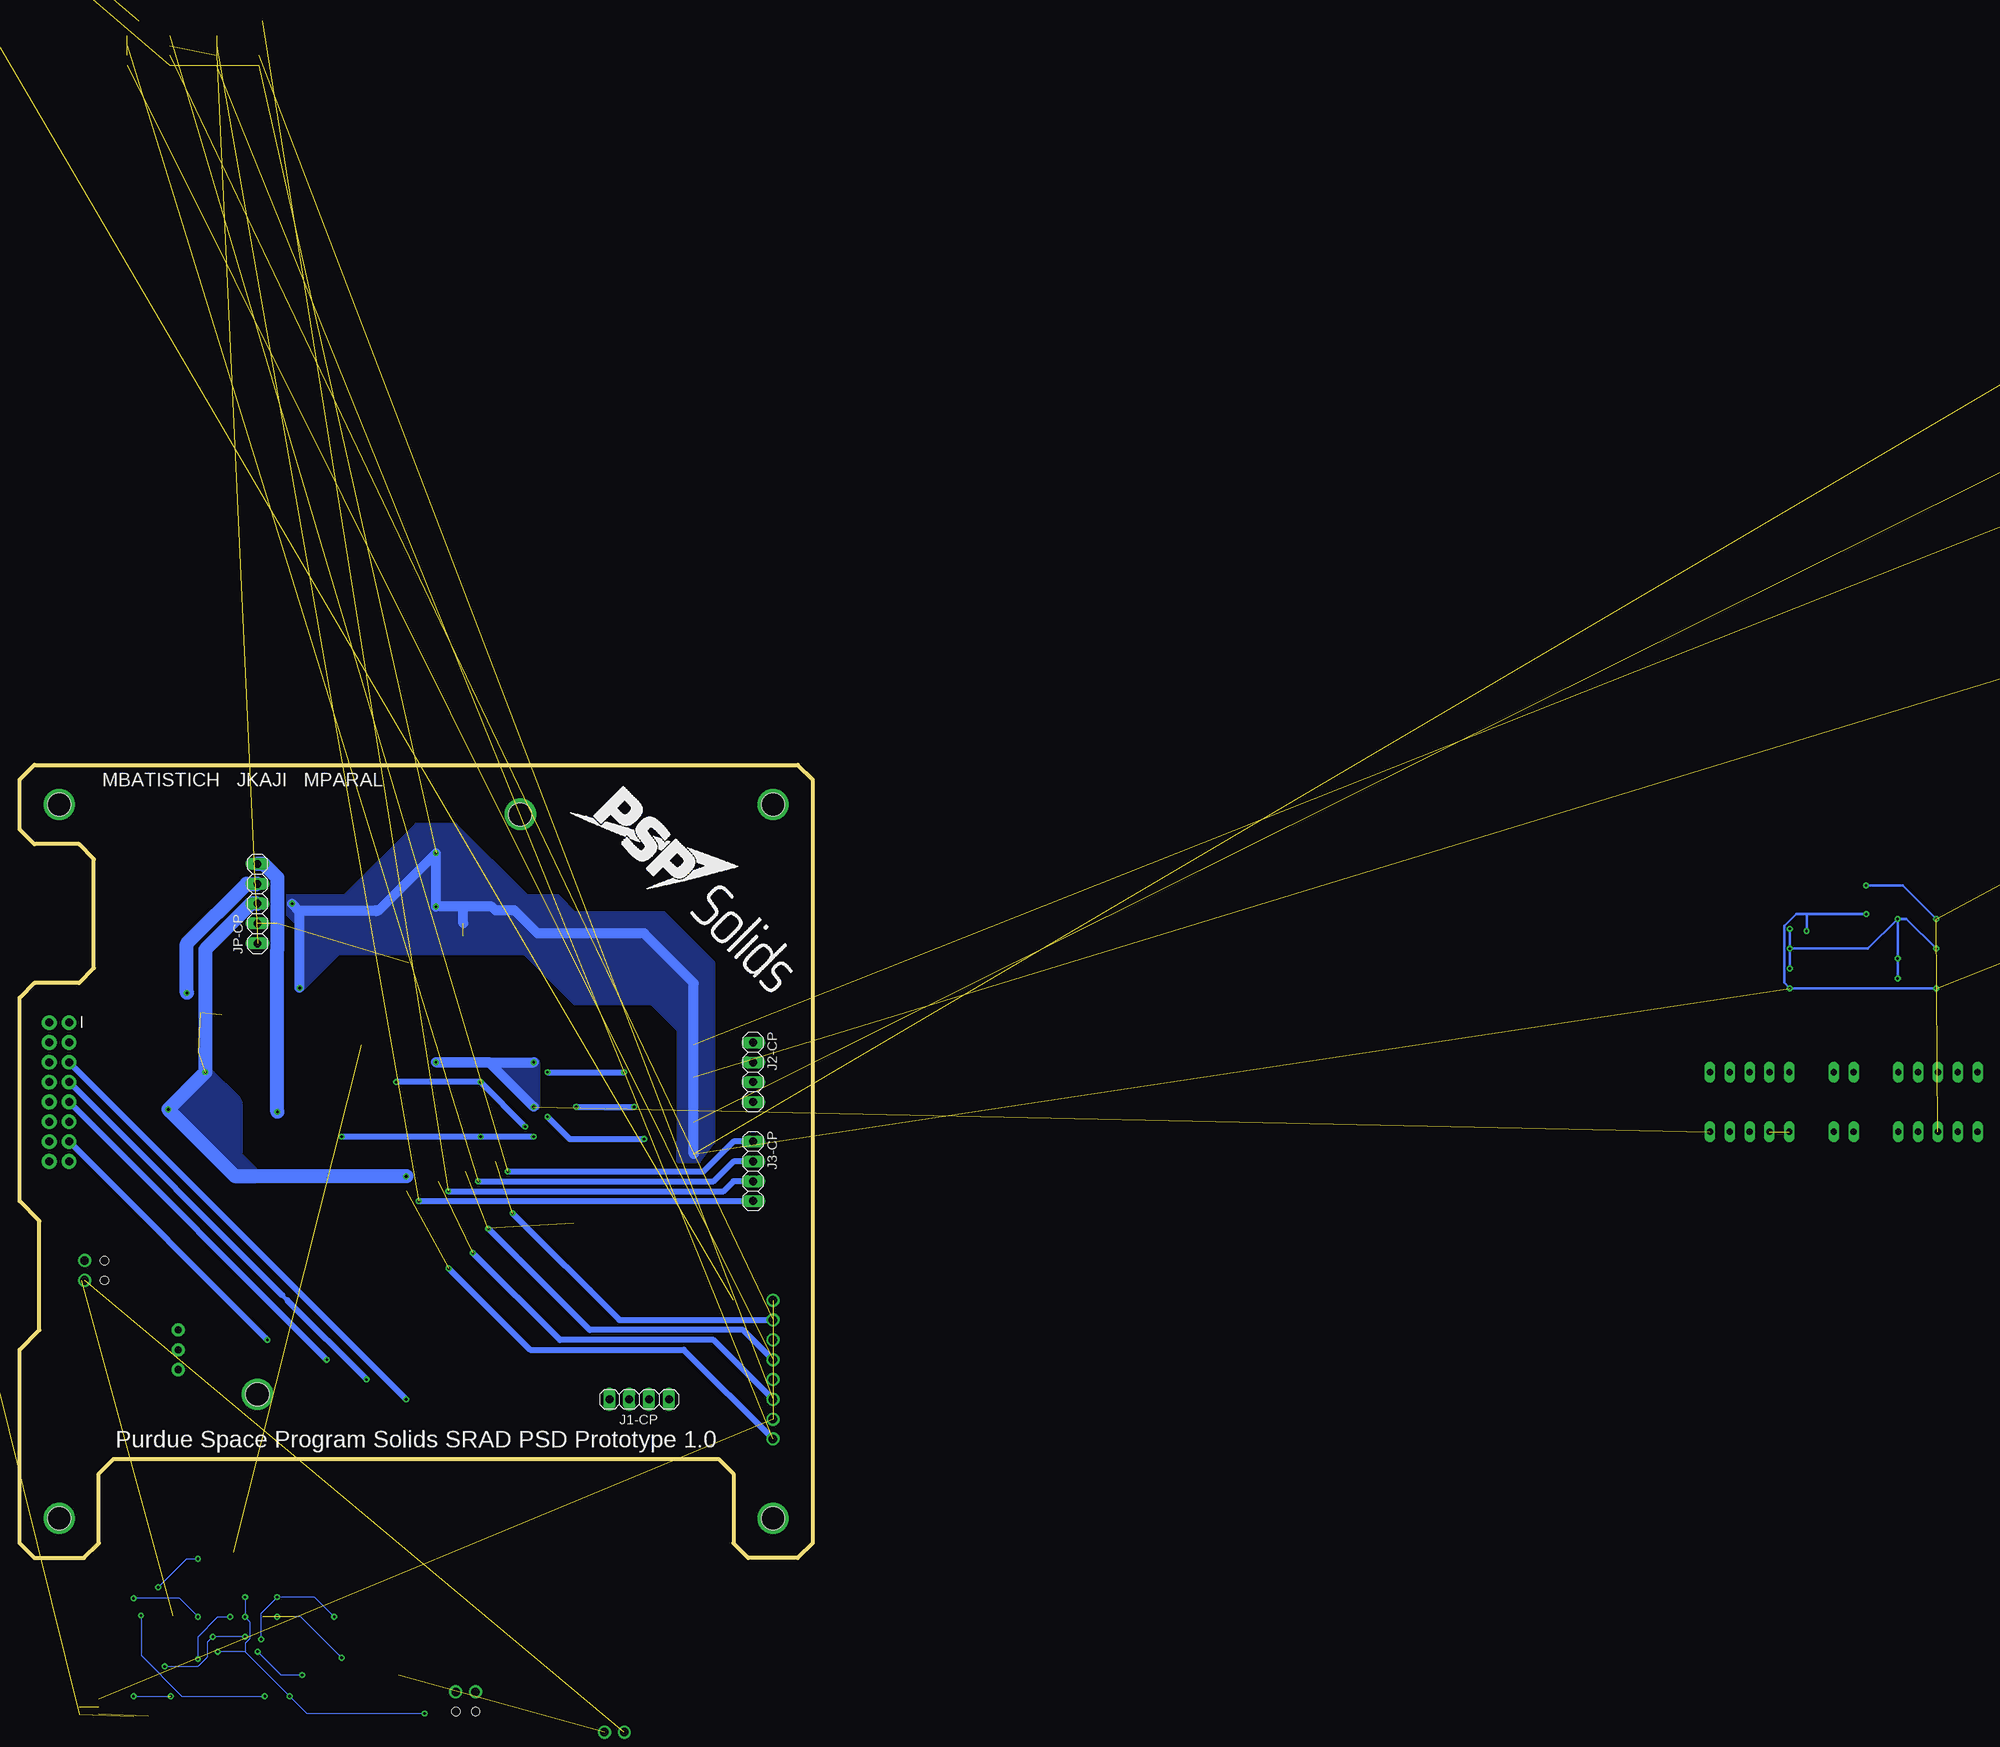
[diagram p6: board, bottom side, seen from below]

Size 101.6 x 101.6 mm. Coordinates in mm from the lower left corner, seen from the top.
Outline: 1.91,0 8.26,0 10.16,1.91 10.16,10.79 12.06,12.7 89.53,12.7 91.44,10.79 91.44,1.91 93.34,0 99.69,0 101.6,1.91 101.6,26.67 99.06,29.21 99.06,43.18 101.6,45.72 101.6,71.75 99.69,73.66 93.98,73.66 92.08,75.56 92.08,89.53 93.98,91.44 99.69,91.44 101.6,93.34 101.6,99.69 99.69,101.6 1.91,101.6 0,99.69 0,1.91 1.91,0
Copper layers (1*16): Top 0.035mm / dielectric 1.5mm / Bottom 0.035mm
Design rules "default *": minimum track width 6mil, minimum drill 0.35mm, track to track 6mil, track to pad 6mil, pad to pad 6mil, via to via 6mil, smd to smd 6mil, copper to edge 40mil, drill to drill 6mil, minimum pad ring 10mil, minimum via ring 8mil, stop-mask expansion 4mil, vias tented up to drill 0mil, thermal gap 10mil
Holes 3 mm at 5.08,96.52 96.52,96.52 96.52,5.08 5.08,5.08 71.12,20.95 37.47,95.25

### Footprints (pad centres in the part's own frame; a part is rotated, then mirrored left to right if it is on the bottom)
1725656 = drill 1.1 pad 1.65: 1 -1.27,3.1; 2 1.27,3.1 | hole 1.1: -1.27,0.56; 1.27,0.56
C0805 = smd 1.3 x 1.5: 1 -0.95,0; 2 0.95,0
CHIPLED_0805 = smd 1.2 x 1.2: A 0,-1.05; C 0,1.05
POWERDI_123 = smd 2.2 x 1.4: 1 -1.6,0 | smd 0.9 x 1.4: 2 0.95,0
SOIC127P599X175-8 = smd 1.775 x 0.602: 1 -2.565,1.905; 2 -2.565,0.635; 3 -2.565,-0.635; 4 -2.565,-1.905; 5 2.565,-1.905; 6 2.565,-0.635; 7 2.565,0.635; 8 2.565,1.905
2X8 = drill 1.016 pad 1.88: 1 0,0; 2 0,2.54; 3 2.54,0; 4 2.54,2.54; 5 5.08,0; 6 5.08,2.54; 7 7.62,0; 8 7.62,2.54; 9 10.16,0; 10 10.16,2.54; 11 12.7,0; 12 12.7,2.54; 13 15.24,0; 14 15.24,2.54; 15 17.78,0; 16 17.78,2.54
1X04 = drill 1.016 long: 1 -3.81,0; 2 -1.27,0; 3 1.27,0; 4 3.81,0
1725711 = drill 1.1 pad 1.65: 1 -8.89,0; 2 -6.35,0; 3 -3.81,0; 4 -1.27,0; 5 1.27,0; 6 3.81,0; 7 6.35,0; 8 8.89,0
1X05 = drill 1.016 long: 1 -5.08,0; 2 -2.54,0; 3 0,0; 4 2.54,0; 5 5.08,0
INDC2012X100N = smd 1.1 x 1.45: 1 -0.9,0; 2 0.9,0
PMN40XPEA = smd 1.224 x 0.497: 1 -1.244,0.95; 2 -1.244,0; 3 -1.244,-0.95; 4 1.244,-0.95; 5 1.244,0; 6 1.244,0.95
POWERPAK-1212-8 = smd 0.99 x 0.405: 1 -1.435,0.99; 2 -1.435,0.33; 3 -1.435,-0.33; 4 -1.435,-0.99; 5 1.435,-0.99; 6 1.435,-0.33; 7 1.435,0.33; 8 1.435,0.99
R0805 = smd 1.3 x 1.5: 1 -0.95,0; 2 0.95,0
M0805 = smd 1.3 x 1.6: 1 -0.95,0; 2 0.95,0
EG1218 = drill 0.9 pad 1.676: O -2.54,0; P 0,0; S 2.54,0
EDG-05 = drill 0.813 long: 1 -5.08,-3.81; 2 -2.54,-3.81; 3 0,-3.81; 4 2.54,-3.81; 5 5.08,-3.81; 6 5.08,3.81; 7 2.54,3.81; 8 0,3.81; 9 -2.54,3.81; 10 -5.08,3.81
EDG-02 = drill 0.813 long: 1 -1.27,-3.81; 2 1.27,-3.81; 3 1.27,3.81; 4 -1.27,3.81
SOT95P270X145-5N = smd 1.4 x 0.6: 1 -1.25,0.95; 2 -1.25,0; 3 -1.25,-0.95; 4 1.25,-0.95; 5 1.25,0.95
SOIC127P600X175-8N = smd 1.525 x 0.65: 1 -2.712,1.905; 2 -2.712,0.635; 3 -2.712,-0.635; 4 -2.712,-1.905; 5 2.712,-1.905; 6 2.712,-0.635; 7 2.712,0.635; 8 2.712,1.905
SOT95P280X145-5N = smd 1.2 x 0.6: 1 -1.25,0.95; 2 -1.25,0; 3 -1.25,-0.95; 4 1.25,-0.95; 5 1.25,0.95
TO185P1524X485-6N = smd 3.725 x 1.097: 1 -6.43,3.7; 2 -6.43,1.85; 3 -6.43,0; 4 -6.43,-1.85; 5 -6.43,-3.7 | smd 3.94 x 10.608: 6 6.322,0
SOT23 = smd 1 x 1.4: 1 -0.95,-1.1; 2 0.95,-1.1; 3 0,1.1
SOIC127P600X175-16N = smd 1.968 x 0.599: 1 -2.473,4.445; 2 -2.473,3.175; 3 -2.473,1.905; 4 -2.473,0.635; 5 -2.473,-0.635; 6 -2.473,-1.905; 7 -2.473,-3.175; 8 -2.473,-4.445; 9 2.473,-4.445; 10 2.473,-3.175; 11 2.473,-1.905; 12 2.473,-0.635; 13 2.473,0.635; 14 2.473,1.905; 15 2.473,3.175; 16 2.473,4.445
SOP65P640X120-24N = smd 1.572 x 0.407: 1 -2.872,3.575; 2 -2.872,2.925; 3 -2.872,2.275; 4 -2.872,1.625; 5 -2.872,0.975; 6 -2.872,0.325; 7 -2.872,-0.325; 8 -2.872,-0.975; 9 -2.872,-1.625; 10 -2.872,-2.275; 11 -2.872,-2.925; 12 -2.872,-3.575; 13 2.872,-3.575; 14 2.872,-2.925; 15 2.872,-2.275; 16 2.872,-1.625; 17 2.872,-0.975; 18 2.872,-0.325; 19 2.872,0.325; 20 2.872,0.975; 21 2.872,1.625; 22 2.872,2.275; 23 2.872,2.925; 24 2.872,3.575

### Placement (x,y rotation side)
1S_LIPO  90.17,36.83 270 top
1S_LIPO1  25.4,-25.4 0 top  (outside the outline)
C1-1P  79.38,69.85 180 top
C1-9P  56.83,68.26 180 top
C1-11P  64.14,53.98 90 top
C2-1P  78.74,62.23 180 top
C2-9P  52.39,68.26 180 top
C3-9P  50.8,76.2 180 top
C4-9P  62.23,73.34 0 top
C4-9P1  76.52,-1.2 270 top
C4-9P2  73.66,-10.09 180 top  (outside the outline)
C4-9P3  77.79,-10.09 180 top  (outside the outline)
CIN  160.02,242.57 0 top  (outside the outline)
COUT  160.02,217.17 0 top  (outside the outline)
D0  -134.94,85.09 180 top  (outside the outline)
D1  -133.03,85.09 180 top  (outside the outline)
D1-1P  73.66,68.58 180 top
D1-1P1  -25.4,0 0 top  (outside the outline)
D1-1P2  60.96,-17.7 270 top  (outside the outline)
D1-1P3  66.04,-20.25 270 top  (outside the outline)
D1-1P4  71.12,-20.25 90 top  (outside the outline)
D1-1P5  60.96,-20.25 270 top  (outside the outline)
D1-1P6  76.2,-17.7 90 top  (outside the outline)
D1-1P7  76.2,-20.25 90 top  (outside the outline)
D1-1P8  -558.8,279.4 0 top  (outside the outline)
D1-1P9  -591.82,223.52 0 top  (outside the outline)
D1-1P10  -558.8,330.2 0 top  (outside the outline)
D1-1P11  -558.8,381 0 top  (outside the outline)
D1-11P  65.72,50.48 0 top
D2  -133.67,66.67 0 top  (outside the outline)
D3  -137.79,66.61 0 top  (outside the outline)
D4  -141.6,66.67 0 top  (outside the outline)
D5  -144.15,66.77 0 top  (outside the outline)
D6  -146.69,66.67 0 top  (outside the outline)
D7  -149.22,66.67 0 top  (outside the outline)
D8  -114.94,66.67 0 top  (outside the outline)
D9  -117.47,66.69 0 top  (outside the outline)
D10  -120.02,66.69 0 top  (outside the outline)
D11  -122.56,66.69 0 top  (outside the outline)
D12  -126.36,66.69 0 top  (outside the outline)
D13  -130.49,66.67 0 top  (outside the outline)
D14  -131.13,85.09 180 top  (outside the outline)
D15  -129.22,85.09 180 top  (outside the outline)
IC1  73.66,-13.89 0 top  (outside the outline)
J1-9P  95.25,68.58 270 top
J1-CP  22.23,20.32 0 bottom
J2-CP  7.62,62.23 270 bottom
J2-P  5.08,24.13 270 top
J3-CP  7.62,49.53 270 bottom
JP-CP  71.12,83.82 90 bottom
L1-9P  57.15,73.18 0 top
P-CHANNEL_MOSFET1  92.71,-19.05 0 top  (outside the outline)
Q1-5P  29.21,43.18 0 top
Q1-6P  29.21,38.1 0 top
R1  69.53,-5 0 top  (outside the outline)
R1-1P  74.61,65.09 0 top
R1-5P  15.24,66.67 90 top
R1-6P  15.24,56.83 90 top
R1-9P  56.83,65.72 0 top
R1-11P  60.33,51.75 270 top
R1-11P1  77.79,-7.54 180 top  (outside the outline)
R1-11P2  55.88,-17.7 0 top  (outside the outline)
R1-11P3  55.88,-20.25 0 top  (outside the outline)
R1-11P4  81.92,-10.09 0 top  (outside the outline)
R1-11P5  86.04,-20.25 180 top  (outside the outline)
R1-11P6  81.28,-20.25 0 top  (outside the outline)
R1-11P7  61.28,-10.09 180 top  (outside the outline)
R1-11P8  65.41,-5 0 top  (outside the outline)
R1-11P9  57.15,-10.09 180 top  (outside the outline)
R1-11P10  66.04,-17.7 0 top  (outside the outline)
R1-11P11  81.28,-17.7 0 top  (outside the outline)
R1-11P12  71.12,-17.7 0 top  (outside the outline)
R1-11P13  69.53,-7.54 0 top  (outside the outline)
R1-11P14  -558.8,304.8 0 top  (outside the outline)
R1-11P15  -617.22,248.92 0 top  (outside the outline)
R1-11P16  -558.8,355.6 0 top  (outside the outline)
R1-11P17  -558.8,406.4 0 top  (outside the outline)
R2  73.66,-5 180 top  (outside the outline)
R2-1P  75.72,68.58 270 top
R2-5P  19.05,67.63 0 top
R2-6P  19.05,57.78 0 top
R2-9P  52.39,65.72 0 top
R2-11P  60.33,56.2 270 top
R3  77.79,-5 180 top  (outside the outline)
R3-9P  62.23,70.8 180 top
R3-11P  67.63,57.15 180 top
R3-11P1  82.87,196.93 0 top  (outside the outline)
R3-11P2  87.31,196.93 180 top  (outside the outline)
R3-11P3  71.44,196.93 0 top  (outside the outline)
R3-11P4  75.88,196.93 180 top  (outside the outline)
R4  84.14,0.07 0 top
R4-5P  40.64,51.75 270 top
R4-6P  48.26,49.21 270 top
R4-9P  65.72,72.07 270 top
R4-11P  68.58,53.98 90 top
R5  84.14,-2.46 0 top
R5-5P  15.24,62.55 90 top
R5-6P  15.24,52.7 90 top
R5-11P  83.82,34.61 180 top
R6  65.41,-10.09 180 top  (outside the outline)
R6-5P  19.05,63.5 0 top
R6-6P  19.05,53.66 0 top
R7  65.41,-7.54 0 top  (outside the outline)
R8  78.74,-13.89 270 top  (outside the outline)
R8-5P  44.45,50.48 270 top
R8-6P  52.07,47.94 270 top
R9  49.85,-13.89 90 top  (outside the outline)
R10  73.66,-7.54 0 top  (outside the outline)
R11  86.04,-17.7 0 top  (outside the outline)
R12  86.04,-10.09 0 top  (outside the outline)
R13  68.58,-14.21 270 top  (outside the outline)
R-EXT  -127.32,81.28 90 top  (outside the outline)
S1-P  81.28,26.67 90 top
SW1  -120.02,58.42 0 top  (outside the outline)
SW2  -144.15,58.42 0 top  (outside the outline)
SW3  -132.08,58.42 0 top  (outside the outline)
TERMINALBLOCK  44.45,-20.25 0 top  (outside the outline)
U1-P  78.74,66.04 90 top
U7-P  33.02,61.59 0 top
U7-P1  71.44,-1.2 0 top
U8-P  33.02,55.88 0 top
U8-P1  85.09,193.12 0 top  (outside the outline)
U8-P2  73.66,193.12 0 top  (outside the outline)
U9-P  53.34,72.39 0 top
U$1  138.43,237.49 0 top  (outside the outline)
U$2  125.73,218.44 0 top  (outside the outline)
U$3  86.04,-13.89 270 top  (outside the outline)
U$4  61.28,-6.43 180 top  (outside the outline)
U$5  81.92,-6.28 180 top  (outside the outline)
U$6  61.28,-13.89 180 top  (outside the outline)
U$7  65.41,-13.89 180 top  (outside the outline)
U$8  86.04,-6.28 180 top  (outside the outline)
U$9  79.69,-1.2 180 top
U$10  57.15,-13.89 180 top  (outside the outline)
U$11  53.02,-13.89 180 top  (outside the outline)
U$12  50.8,-18.98 270 top  (outside the outline)
U$13  81.92,-13.89 270 top  (outside the outline)
U$14  69.53,-10.4 270 top  (outside the outline)
U$15  -577.85,243.84 0 top  (outside the outline)
U$16  -584.2,304.8 0 top  (outside the outline)
U$17  -584.2,355.6 0 top  (outside the outline)
U$18  -584.2,406.4 0 top  (outside the outline)
U$19  -141.46,77.42 0 top  (outside the outline)
U$20  -132.08,78.74 0 top  (outside the outline)
U$21  -122.7,77.42 0 top  (outside the outline)

### Tracks (layer width: path | path; a pad name or v marks a point on that pad's centre or on a via)
3V3  (via drill 0.35)  (16 unrouted)
  Top 0.152: D0.A D1.A -132.72,86.14 -131.44,86.14 D14.A | v78.74,-0.1 76.67,-0.1 C4-9P1.1 75.56,0.71 U7-P1.8 73.66,0.71 72.71,-0.24 R2.2 | U8-P1.2 82.87,193.75 83.82,194.7 R3-11P1.2 R3-11P2.2 | R3-11P2.2 | R3-11P3.2 R3-11P4.2 74.93,196.46 U8-P2.8 | U8-P1.8 86.36,196.46 R3-11P2.2 | R3-11P3.2 72.39,194.7 71.44,193.75 U8-P2.2 | R1-11P6.2 82.23,-18.02 82.55,-17.7 | R1-11P13.2 R10.1 | U$8.2 | U$8.2 85.09,-5.02 v83.82,-3.75 | R11.2 86.99,-15.57 88.07,-14.49 88.07,-13.3 86.99,-12.22 R12.2 86.99,-6.8 85.37,-5.17 U$8.2 | R3-11P3.2 | TERMINALBLOCK.2 48.5,-19.93 U$12.2
  Top 0.305: D0.A -132.72,86.14 | D1.A -131.44,86.14 | D14.A D15.A -128.27,85.19 -128.27,83.25 | U$20.24 -128.27,83.25 | -128.27,83.25 -126.43,83.25 -125.18,82 U$21.1 | SW2.1 SW2.2 SW2.3 SW2.4 SW2.5 SW3.1 SW3.2 SW1.1 | SW1.2 SW1.3 SW1.4 SW1.5
  Top 0.508: R3-9P.2 61.28,71.12 | 60.96,73.34 C4-9P.1 R3-9P.2 | 60.96,73.34 58.21,73.34 L1-9P.2 58.05,68.53 C1-9P.1 R1-9P.2 61.28,69.22 R3-9P.2 | JP-CP.1 66.36,78.74 60.96,73.34
  Top 1.27: R1-9P.2 57.78,64.77 56.52,63.5 v48.26,63.5
  Bottom 0.152: R11.2 R1-11P11.2 | U$12.2 64.77,-19.93 R1-11P10.2 72.7,-11.99 | 72.7,-11.99 IC1.8 | v83.82,-3.75 80.17,-0.1 v78.74,-0.1 | 72.7,-11.99 72.7,-10.94 72.1,-10.34 72.1,-8.15 R10.1 R2.2
  Bottom 0.305: U$19.1 -139.66,86.14 D0.A
  Bottom 1.27: U7-P.8 v48.26,63.5 41.45,63.5 v35.73,57.78
  other vias: 35.73,63.5 -143.93,81.87 -134.94,86.14 86.99,-17.7 82.23,-17.7 49.7,-19.93 66.99,-17.7 76.23,-11.99 72.71,-7.54 72.71,-5
  pour Top (no thermals): 71.75,79.69 62.87,79.69 57.15,73.98 57.15,69.06 57.31,68.9 57.31,66.04 58.26,66.04 61.75,69.53 61.75,73.98 65.56,77.79 71.75,77.79 72.39,78.42 72.39,79.06
  pour Bottom (no thermals): 35.56,63.5 35.56,57.78 41.27,63.5
5V  (2 unrouted)
  Top 0.508: U9-P.3 53.02,71.44 53.34,71.75 53.34,73.03 53.02,73.34 U9-P.1 52.09,75.86 C3-9P.1
  Top 1.27: J1-9P.14 99.69,55.24 99.69,70.48 98.42,71.75 93.19,71.75 83.67,81.28 68.58,81.28
  pour Top (no thermals): 62.99,83.82 50.8,83.82 49.99,84.63 49.99,87.71 50.67,88.39 60.07,88.39 62.99,85.47
  pour Top (no thermals): 50.8,83.82 51.28,83.34 51.28,73.34 51.59,73.03 53.5,73.03 53.66,73.18 53.66,73.82 62.99,83.15 62.99,84.14 51.12,84.14
  pour Top (no thermals): 62.55,80.33 71.75,80.33 72.23,80.8 72.23,81.76 71.75,82.23 66.36,82.23 60.17,88.42 60.17,80.33 54.13,74.3 56.52,74.3
ARM_GPIO
  Top 0.152: R5.2 R4.2
ARMING_CHARGE
  Top 0.152: U$9.3 76.67,-2.29 | 76.67,-2.29 C4-9P1.2 76.2,-1.83 U7-P1.6 | 76.67,-2.29 76.52,-2.44 76.52,-3.42 76.84,-3.74 R3.2 R1-11P1.2
BATT_MEAS  (via drill 0.35)
  Top 1.27: R4-11P.2 R3-11P.1
  Bottom 1.778: R3-11P.1 68.58,77.97 68.56,77.99 68.56,87.11 70.35,88.9 JP-CP.5
  other vias: 68.58,57.15
CHECK_HDD
  Top 0.152: R1-11P7.2 58.42,-10.09 | 58.42,-10.09 R1-11P9.1 | TERMINALBLOCK.1 51.51,-8.81 57.15,-8.81 58.42,-10.09
CMP_ARM_DIV
  Top 0.152: U7-P1.5 74.15,-3.42 74.61,-3.88 R2.1 73.34,-6.28 71.75,-6.28 R1.2
CMP_LDO_IN  (via drill 0.35)
  Top 0.508: R2-11P.2 60.64,55.25
  Top 0.762: U8-P.3 31.27,55.24 32.55,53.98 U8-P.5 | U7-P.3 31.11,60.96 32.38,59.69 U7-P.5 36.83,59.69 v42.55,53.98
  Top 1.27: R2-11P.2 v60.33,53.98 R1-11P.1
  Bottom 0.762: v60.33,53.98 v42.55,53.98 U8-P.5
  other vias: 35.73,53.98
CMP_LDO_OUT_1
  Top 0.508: 20.32,67.63 R2-5P.2
  Top 0.61: Q1-5P.2 26.66,43.51 25.4,44.77 25.4,63.5
  Top 0.762: U7-P.1 25.4,63.5 21.27,67.63 20.32,67.63
  pour Top (no thermals): 21.27,67.63 26.04,67.63 30.16,63.5 25.4,63.5
  pour Top (no thermals): 29.53,63.5 25.4,59.37 25.4,63.5
CMP_LDO_OUT_2  (via drill 0.35)
  Top 0.61: Q1-5P.4 26.39,42.19 24.13,44.45 v24.13,62.23
  Top 0.762: U7-P.7 v33.97,62.23 | v24.13,62.23 22.86,63.5 R6-5P.2
  Bottom 0.762: v33.97,62.23 v24.13,62.23
  pour Top (no thermals): 20,63.5 24.13,59.37 24.13,62.23 22.86,63.5
CMP_LDO_OUT_3  (via drill 0.35)
  Top 0.508: Q1-6P.2 26.66,38.43
  Top 0.61: 26.66,38.43 22.86,42.23 v22.86,57.78
  Top 0.762: R2-6P.2 v22.86,57.78
  Bottom 0.762: v30.31,57.78 v22.86,57.78
  pour Top (no thermals): 22.86,57.78 20,57.78 22.86,54.93
CMP_LDO_OUT_4  (via drill 0.35)
  Top 0.508: Q1-6P.4 26.39,37.11
  Top 0.61: 26.39,37.11 21.59,41.91 v21.59,53.66
  Top 0.762: U8-P.7 v33.97,56.52 | v21.59,53.66 R6-6P.2
  Bottom 0.762: v33.97,56.52 31.11,53.66 v21.59,53.66
  pour Top (no thermals): 21.59,53.66 20,53.66 21.59,52.07
CMP_RAIL  (via drill 0.35)
  Top 0.508: 30.48,56.52 U8-P.2 | R4-9P.2 65.4,70.8 | 63.5,70.8 R3-9P.1
  Top 0.762: U8-P.2 32.38,56.52 33.66,55.24 U8-P.6 v36.83,55.24 | U7-P.2 32.38,62.23 33.66,60.96 U7-P.6 v42.55,60.96 | 65.4,70.8 63.5,70.8 63.5,68.58 55.88,60.96 v53.34,60.96
  Bottom 0.762: v36.83,55.24 v42.55,60.96 v53.34,60.96
  pour Top (no thermals): 63.5,70.8 63.5,68.58 65.72,70.8
CTS  (via drill 0.35)
  Top 0.762: J1-CP.4 18.41,20.95 25.4,27.94 v69.85,27.94
  Bottom 0.762: v69.85,27.94 J1-9P.13
D1-1P_R1-1P
  Top 1.778: D1-1P.C R1-1P.1
FET_A  (via drill 0.35)  (2 unrouted)
  Top 0.254: Q1-5P.7 Q1-5P.8
  Top 0.762: Q1-5P.8 v38.45,44.17
  Bottom 0.762: v38.45,44.17 24.76,30.48 J2-P.2
FET_B  (via drill 0.35)  (3 unrouted)
  Top 0.254: Q1-5P.6 Q1-5P.5
  Bottom 0.762: v41.55,42.19 28.57,29.21 8.89,29.21 J2-P.4
FET_C  (via drill 0.35)  (2 unrouted)
  Top 0.254: Q1-6P.8 Q1-6P.7
  Top 0.762: Q1-6P.8 v43.53,39.09 | R4-6P.2 47.95,48.26
  Bottom 0.762: J2-P.6 12.7,27.94 32.38,27.94 v43.53,39.09
FET_D  (via drill 0.35)  (2 unrouted)
  Top 0.254: Q1-6P.6 Q1-6P.5
  Top 0.762: 30.68,37.15 Q1-6P.5 v46.63,37.11
  Bottom 0.762: v46.63,37.11 36.19,26.67 16.51,26.67 J2-P.8
FIRE_A
  Top 0.508: R2-5P.1
  Top 0.762: R2-5P.1 R1-5P.2 9.21,67.62 J2-CP.1
FIRE_B
  Top 0.508: J2-CP.2 | R5-5P.2
  Top 0.762: J2-CP.2 R5-5P.2 | R5-5P.2 R6-5P.1
FIRE_C
  Top 0.508: R1-6P.2 | R2-6P.1
  Top 0.762: R1-6P.2 12.06,57.78 8.89,60.96 J2-CP.3 8.26,60.96 | R1-6P.2 R2-6P.1
FIRE_D
  Top 0.508: R6-6P.1
  Top 0.762: R6-6P.1 R5-6P.2 13.02,53.66 8.26,58.42 J2-CP.4
GND  (via drill 0.35)  (18 unrouted)
  Top 0.152: U$20.21 -127.35,80.36 R-EXT.1 | -134.95,82.4 U$20.1 v-134.95,82.48 | U$11.3 U$10.3 U$6.3 | U$6.3 61.28,-15.16 62.01,-15.9 D1-1P2.C D1-1P5.C 63.28,-21.52 68.8,-21.52 D1-1P4.C | U$7.3 U$6.3 | R1.1 68.58,-3.24 U7-P1.4 | IC1.1 71.09,-11.51 70.63,-11.05 U$14.3 72.39,-10.4 C4-9P2.2 | U$13.3 U$3.3 86.98,-13.89 86.04,-12.95 86.04,-9.28 84.14,-7.38 U$5.3
  Top 0.254: 48.26,83.86 v48.26,83.44
  Top 0.381: 28.61,43.16 28.61,43.85 | 28.61,43.85 28.31,44.16 27.79,44.16 Q1-5P.1 28.47,44.87 | 28.61,43.16 28.31,42.86 27.79,42.86 Q1-5P.3 28.31,42.85 28.61,42.55 | 30.31,46.7 28.47,44.87 | 28.61,38.77 28.3,39.09 Q1-6P.1 28.33,39.09 28.61,39.37 | Q1-6P.3 28.3,37.77 28.61,38.09 28.61,38.77 | 28.61,38.77 28.61,39.37 | 28.61,39.37 28.61,42.55 | 28.61,42.55 28.61,43.16 | 28.61,43.85 28.61,44.73 28.47,44.87
  Top 0.508: R8-6P.1 50.8,50.16 R4-6P.1 46.99,51.43 R8-5P.1 43.18,52.7 R4-5P.1 30.31,52.7 | U7-P.4 29.84,59.69 28.89,58.74 28.89,54.61 29.53,53.98 U8-P.4 30.31,52.7 | U9-P.2 50.8,72.39 49.85,73.34 | 65.4,73.34 R4-9P.1 | 30.31,52.7 30.31,46.7
  Top 0.762: C4-9P.2 65.4,73.34
  Top 1.27: R2-9P.1 C2-9P.2 49.85,69.85 49.85,73.34 C3-9P.2 48.26,76.2 44.77,79.69 | R2-11P.1 64.14,57.15 | 64.14,57.15 R3-11P.2 66.68,59.06 69.85,62.23 C2-1P.2 | C1-11P.2 64.14,57.15
  Top 1.778: 93.66,35.56 95.25,37.15 J1-9P.15 89.22,50.8 v82.55,57.47 | JP-CP.3 v66.67,83.82
  Bottom 0.152: U$7.3 68.09,-14.99 IC1.1 | C4-9P2.2 C4-9P3.2 77.47,-10.72 77.47,-12.62 78.74,-13.89 U$13.3 | U$4.3 63.81,-5 R1.1 | R1.1 | U$14.3 70.63,-7.06 R1.1
  Bottom 0.305: -127.32,82.48 -125.97,82.48 -124.46,80.96 -124.46,73.7 U$21.8 U$19.8 | -127.32,82.48 v-134.95,82.48 | R-EXT.1 -127.32,82.48
  Bottom 1.27: v66.67,83.82 65.83,82.97 | 65.83,82.97 55.98,82.97 | 55.98,82.97 55.88,82.87 | 55.98,82.97 55.59,82.97 v48.26,90.3 v48.26,83.44 44.77,83.44 | 44.77,83.44 41.11,83.44 40.64,82.97 38.2,82.97 35.24,80.01 21.59,80.01 15.24,73.66 15.24,51.76 | 44.77,81.28 44.77,83.44 | R4-9P.1 65.72,82.87 65.83,82.97
  Bottom 1.778: v82.55,57.47 C2-1P.2 77.79,77.92 71.89,83.82 JP-CP.3 | v82.55,57.47 | R8-6P.1 73.97,48.89 v82.55,57.47
  other vias: 77.79,62.23 65.72,73.02 52.07,48.89 -127.32,80.33 -125.18,72.98 -143.93,72.98 65.41,-14.99 71.09,-11.99 72.71,-10.09 76.84,-10.09 61.28,-7.53 68.58,-5 70.63,-10.4 70.63,-10.4 83.02,-13.89
  pour Top (no thermals): 76.96,61.21 78.23,61.21 78.61,61.59 78.61,63.37 78.99,63.75 78.99,70.61 78.74,70.87 75.18,70.87 74.93,70.61 74.93,68.83 75.18,68.58 78.23,68.58 78.49,68.33 78.49,64.01 77.6,63.12 76.96,63.12
  pour Bottom (no thermals): 67.31,84.77 32.7,84.77 30.48,82.55 30.48,80.01 33.02,77.47 62.23,77.47 67.31,82.55
  pour Bottom (no thermals): 17.14,53.34 12.7,53.34 12.7,71.12 15.24,73.66 17.14,71.75
  pour Bottom (no thermals): 12.7,71.12 12.7,76.2 19.05,82.55 38.1,82.55 38.1,78.74 30.48,71.12
  pour Bottom (no thermals): 36.51,84.77 45.72,93.98 50.8,93.98 60.01,84.77
  pour Bottom (no thermals): 17.14,67.63 20.64,71.12 17.14,71.12
  pour Bottom (no thermals): 12.7,53.34 14.61,50.8 17.14,50.8 17.14,53.34
  pour Top (no thermals): 30.48,59.37 29.53,59.37 28.89,58.74 28.89,54.61 29.53,53.98 31.11,53.98 32.07,53.02 49.21,53.02 52.7,49.53 52.7,48.26 51.44,48.26 51.44,49.53 50.8,50.16 48.26,50.16 46.99,51.44 42.23,51.44 41.59,52.07 36.2,52.07 28.26,44.13 27.3,44.13 27.3,58.42 28.89,60.01 30.48,60.01 30.8,59.69
  pour Top (no thermals): 51.28,72.39 50.16,71.28 50.16,73.5
  pour Top (no thermals): 47.78,84.61 47.78,83.9 48.26,83.42 48.26,84.61
  pour Top (no thermals): 82.55,57.47 82.55,53.02 95.25,40.32 95.25,50.8 89.22,50.8
  pour Top (no thermals): 60.01,57.15 65.09,62.23 77.79,62.23 74.61,59.05 67.63,59.05 65.72,57.15
  pour Bottom (no thermals): 65.72,73.03 60.64,78.11 63.5,80.96 65.72,80.96
  pour Bottom (no thermals): 77.79,62.23 73.98,58.42 73.98,48.9 82.55,57.47 78.11,61.91 77.79,61.91
  pour Bottom (no thermals): 73.98,51.44 73.98,48.9 71.44,48.9
IO_CLK
  Top 0.152: U$20.3 -136.26,81.02 -136.84,81.6 -136.84,87.63
IO_LE
  Top 0.152: U$20.4 -136.25,80.36 -137.16,81.28 -137.16,87.63
IO_SDI
  Top 0.152: U$20.2 -136.28,81.67 -136.53,81.92 -136.53,87.63
LED_SINK_0
  Top 0.152: D0.C -133.94,83.04 -133.94,80.07 -134.29,79.72 U$20.5
LED_SINK_1
  Top 0.152: D1.C -133.03,80.32 -134.29,79.06 U$20.6
LED_SINK_2
  Top 0.152: U$19.14 -138.95,79.36 -137.71,79.36 -136.75,78.42 U$20.7 -134.19,78.42 -132.23,76.45 -132.23,69.16 D2.C
LED_SINK_3
  Top 0.152: U$19.3 -143.36,79.33 -142.71,78.67 -137.71,78.67 -136.79,77.77 U$20.8 -134.15,77.77 -132.54,76.15 -132.54,73.84 -137.79,68.58 D3.C
LED_SINK_4
  Top 0.152: -143.31,76.79 U$19.5 -143.34,76.79 -142.71,77.42 -137.71,77.42 -137.4,77.11 U$20.9 -134.11,77.11 -132.84,75.84 -132.84,73.96 -137.29,69.52 -139.81,69.52 D4.C
LED_SINK_5
  Top 0.152: U$19.11 -138.36,75.52 -137.41,76.47 U$20.10 -134.07,76.47 -133.15,75.54 -133.15,74.09 -137.39,69.85 -142.11,69.85 D5.C
LED_SINK_6
  Top 0.152: U$19.7 -143.38,74.25 -142.71,74.92 -137.71,74.92 -136.81,75.81 U$20.11 -134.03,75.81 -133.45,75.23 -133.45,74.22 -137.51,70.16 -144.25,70.16 D6.C
LED_SINK_7
  Top 0.152: U$19.9 -138.4,72.98 -136.22,75.17 U$20.12 -133.99,75.17 -133.76,74.93 -133.76,74.34 -137.64,70.46 -146.49,70.46 D7.C
LED_SINK_8
  Top 0.152: U$21.9 -120.76,72.98 -121.45,73.67 -126.45,73.67 -127.94,75.17 U$20.13 -130.17,75.17 -130.4,74.93 -130.4,74.41 -126.43,70.43 -117.64,70.43 D8.C
LED_SINK_9
  Top 0.152: U$21.7 -125.78,74.25 -127.34,75.81 U$20.14 -130.13,75.81 -130.71,75.23 -130.71,74.28 -126.55,70.13 -119.87,70.13 D9.C
LED_SINK_10
  Top 0.152: U$21.11 -120.8,75.52 -121.45,76.17 -126.45,76.17 -126.75,76.47 U$20.15 -130.09,76.47 -131.01,75.54 -131.01,74.09 -126.75,69.83 -122.11,69.83 D10.C
LED_SINK_11
  Top 0.152: D11.C -124.34,69.52 -126.87,69.52 -131.32,73.96 -131.32,75.84 -130.05,77.11 U$20.16 -126.77,77.11 -126.44,76.79 U$21.5
LED_SINK_12
  Top 0.152: U$21.14 -120.8,79.33 -121.45,78.67 -126.45,78.67 -127.36,77.77 U$20.17 -130.01,77.77 -131.62,76.15 -131.62,73.84 -126.36,68.58 D12.C
LED_SINK_13
  Top 0.152: U$21.3 -126.42,79.33 -127.34,78.42 U$20.18 -129.97,78.42 -131.93,76.45 -131.93,69.16 D13.C
LED_SINK_14
  Top 0.152: D14.C -131.13,80.32 -129.87,79.06 U$20.19
LED_SINK_15
  Top 0.152: U$20.20 -129.87,79.72 -130.22,80.07 -130.22,83.04 D15.C
MASTER_RX-2  (via drill 0.35)
  Top 0.762: v57.15,22.86 25.4,22.86 23.5,20.95 J1-CP.2
  Bottom 0.508: 67.94,33.66 67.31,33.02
  Bottom 0.762: J1-9P.7 67.94,33.66 | 67.31,33.02 v57.15,22.86
MASTER_TX-2  (via drill 0.35)
  Top 0.762: J1-CP.3 20.95,20.95 25.4,25.4 v62.23,25.4
  Bottom 0.762: v62.23,25.4 J1-9P.9
N$1  (via drill 3 pad 4)
  other vias: 5.08,5.08
N$2  (via drill 3 pad 4)
  other vias: 71.12,20.95
N$3  (via drill 3 pad 4)
  other vias: 5.08,96.52
N$4  (via drill 3 pad 4)
  other vias: 96.52,96.52
N$5  (via drill 3 pad 4)
  other vias: 96.52,5.08
N$6  (via drill 3 pad 4)
  other vias: 37.47,95.25
N$7  (1 unrouted)
N$9
  Top 0.152: U$4.1 62.56,-5 R1-11P8.1
N$10  (via drill 0.35)
  Top 0.152: 86.99,-5.33 v86.99,-5.17
  Bottom 0.152: R1-11P1.1 81.11,-5.17 v86.99,-5.17
  other vias: 78.74,-7.54
N$11
  Top 0.152: D1-1P3.C 66.04,-19.2 66.04,-16.12 66.36,-15.8 66.36,-14.21 66.04,-13.89 65.56,-13.89 U$7.2
N$12
  Top 0.152: R7.1 R6.2 63.34,-11.2 63.34,-13.42 62.87,-13.89 57.3,-13.89 U$10.2
N$13
  Top 0.152: U$7.1 R6.1
N$14  (1 unrouted)
  Top 0.152: R1-11P5.2 86.04,-19.3 86.04,-15.95 U$3.2
N$15
  Top 0.152: U$3.1 82.86,-10.87 R1-11P4.2
N$16  (via drill 0.35)
  Top 0.152: U7-P1.7 74.3,-0.56 74.93,-1.2 80.64,-1.2 81.92,-2.46 81.92,-5.8 80.97,-6.75 R1-11P4.1 80.97,-9.77 79.85,-8.66 69.69,-8.66 R1-11P13.1 68.58,-7.23 R1-11P8.2
  Bottom 0.152: U$6.2 65.58,-7.54 R1-11P13.1
  other vias: 60.33,-12.79 68.58,-7.54
N$17
  Top 0.152: U$5.1 82.86,-2.79 R5.1
N$18
  Top 0.152: U$6.1 R1-11P7.1
N$19
  Top 0.152: R1-11P3.1 R1-11P2.1 53.66,-18.98 U$12.3
N$20
  Top 0.152: U$11.1 53.97,-12.31 R1-11P9.2 58.1,-11.98 U$10.1
N$21
  Top 0.152: R3.1 80.8,-5 U$5.2
N$22
  Top 0.152: R1-11P2.2 D1-1P2.A
N$23
  Top 0.152: R1-11P10.1 64.99,-17.8 D1-1P3.A
N$24
  Top 0.152: R12.1 83.82,-8.81 82.41,-8.81 81.92,-9.31 81.92,-11.85 U$13.1 80.81,-12.63 79.85,-11.66 79.85,-9.29 79.52,-8.96 69.46,-8.96 69.23,-8.72 68.01,-8.72 67.47,-8.18 67.47,-6.91 66.83,-6.28 61.27,-6.28 U$4.2
N$25
  Top 0.152: D1-1P6.A R1-11P11.1
N$26
  Top 0.152: R9.1 49.85,-17.88 U$12.1
N$27  (via drill 0.35)
  Bottom 0.152: U$8.3 86.04,-12.46 80.79,-17.7 R1-11P12.1
  other vias: 86.04,-7.38 70.17,-17.7
N$28
  Top 0.152: D1-1P4.A 72.17,-17.8 R1-11P12.2
N$29
  Top 0.152: R9.2 50,-12.79 U$11.2
N$30
  Top 0.152: R4.1 83.02,-0.1 U$9.1
N$31
  Top 0.152: R1-11P3.2 D1-1P5.A
N$32
  Top 0.152: IC1.4 73.82,-15.8 74.77,-16.75 78.91,-16.75 U$13.2 82.23,-14.85 R11.1
N$33
  Top 0.152: 68.58,-9.45 U$14.1 69.53,-10.55 69.53,-12.31 R13.1
N$34
  Top 0.152: 76.83,-15.8 IC1.5 75.56,-15.8 74.61,-14.85 C4-9P2.1
N$35
  Top 0.152: IC1.2 71.75,-13.26 74.93,-16.43 77.15,-16.43 78.58,-15.01 | 78.58,-15.01 R8.2 79.72,-13.87 79.72,-12.2 78.74,-11.22 C4-9P3.1 | IC1.6 78.11,-14.53 78.58,-15.01
N$36  (via drill 0.35)
  Top 0.152: IC1.7 78.42,-13.26 R8.1
  Bottom 0.152: R8.1 78.74,-10.09 76.2,-7.54 R10.2
  other vias: 78.74,-12.95 74.61,-7.54
N$37
  Top 0.152: R13.2 69.85,-15.16 70.41,-14.61 IC1.3
N$38
  Top 0.152: D1-1P7.A R1-11P6.1
N$39
  Top 0.152: D1-1P7.C D1-1P6.C 73.88,-16.43 67.94,-16.43 67.31,-15.8 67.31,-12.47 U$14.2
N$40  (1 unrouted)
N$41  (1 unrouted)
N$42  (1 unrouted)
N$43  (1 unrouted)
N$44  (1 unrouted)
N$45  (1 unrouted)
N$46  (1 unrouted)
N$47  (1 unrouted)
N$48  (1 unrouted)
N$49  (1 unrouted)
N$50  (1 unrouted)
N$51  (1 unrouted)
N$52
  Top 0.152: SW2.10 D7.A
N$53
  Top 0.152: U$20.23 -127.88,81.67 R-EXT.2
N$54
  Top 0.152: D3.A -137.79,63.5 SW2.6
N$55
  Top 0.152: D4.A SW2.7
N$56
  Top 0.152: SW2.8 D5.A
N$57
  Top 0.152: SW2.9 D6.A
N$58
  Top 0.152: D2.A -133.35,65.31 SW3.4
N$59
  Top 0.152: D12.A -126.36,63.5 SW1.10
N$61
  Top 0.152: D11.A SW1.9
N$62
  Top 0.152: SW1.8 D10.A
N$64
  Top 0.152: D9.A SW1.7
N$65
  Top 0.152: SW1.6 D8.A
N$66
  Top 0.152: SW3.3 -130.81,65.31 D13.A
RTS  (via drill 0.35)
  Top 0.762: J1-CP.1 v52.07,20.32
  Bottom 0.762: J1-9P.5 v52.07,20.32
SENSE_A  (via drill 0.35)  (1 unrouted)
  Top 0.152: U8-P1.1 82.38,195.51 81.92,195.97 R3-11P1.1
  Bottom 0.762: J3-CP.1 10.16,53.34 13.97,49.53 v39.05,49.53
  pour Top (no thermals): 40.64,51.12 39.05,49.53 40.64,47.94 41.27,48.58 41.27,50.48
SENSE_B  (via drill 0.35)  (1 unrouted)
  Top 0.152: R3-11P2.1 88.26,196.29 88.9,195.66 88.9,194.38 88.27,193.75 U8-P1.7
  Bottom 0.762: J3-CP.2 10.16,50.8 12.7,48.26 v42.86,48.26
  pour Top (no thermals): 44.45,49.85 42.86,48.26 44.45,46.67 45.09,47.31 45.09,49.21
SENSE_C  (via drill 0.35)  (1 unrouted)
  Top 0.152: R3-11P3.1 70.49,196.12 70.95,195.66 U8-P2.1
  Bottom 0.762: J3-CP.3 10.16,48.26 11.43,46.99 v46.67,46.99
  pour Top (no thermals): 46.67,46.99 48.26,45.4 48.9,46.04 48.9,47.94 48.26,48.58
SENSE_D  (via drill 0.35)  (1 unrouted)
  Top 0.152: R3-11P4.1 76.83,196.29 77.47,195.66 77.47,194.38 76.83,193.75 U8-P2.7
  Bottom 0.762: v50.48,45.72 J3-CP.4
  pour Top (no thermals): 52.07,47.31 50.48,45.72 52.07,44.13 52.7,44.77 52.7,46.67
SWITCH_PLEX_READ  (via drill 0.35)
  Top 0.152: -124.59,78.06 U$21.4 | U$21.6 -124.55,75.52 | -120.76,81.87 U$21.16 | U$19.10 -139.63,74.25 | U$19.12 -139.59,76.79 | -139.51,81.87 U$19.16 -138.47,81.87 -137.48,82.87 -137.48,87.63
  Top 0.305: U$21.12 -123.32,76.79 -124.59,78.06 | U$21.10 -123.28,74.25 -124.55,75.52 | U$21.2 -122.03,80.6 -120.76,81.87 | U$19.6 -140.86,75.52 -139.59,76.79 | U$19.2 -140.78,80.6 -139.51,81.87
  Bottom 0.305: U$19.10 U$19.12 U$19.16 | U$19.4 -140.12,81.87 U$19.16 | U$21.6 U$21.4 | U$21.4 U$21.2 | U$19.16 -135.17,78.06 U$21.4
  other vias: -138.98,74.25 -138.98,76.79 -138.98,81.87 -143.93,78.06 -125.18,80.6 -125.18,78.06 -125.18,75.52
U1P-PROG
  Top 0.508: U1-P.5 76.06,67.29 R2-1P.2
U1P-STAT
  Top 0.508: U1-P.1 75.86,64.79 R1-1P.2
U2P-FB
  pour Top (no thermals): 49.21,84.3 49.21,83.42 47.7,81.92 46.04,81.92 46.04,80.57 46.75,80.57 49.29,78.03 50.4,78.03 50.4,83.26 49.37,84.3
U9P-FB
  Top 0.508: 54.63,69.52 54.59,69.52
  Top 1.27: R1-9P.1 C1-9P.2 54.63,69.52 | R2-9P.2 C2-9P.1 54.59,69.52 U9-P.4
  pour Top (no thermals): 53.34,65.41 55.88,65.41 55.88,68.26 54.61,69.53 53.34,68.26
U9P-LX1
  pour Top (no thermals): 47.78,88.03 47.78,93.19 46.51,93.19 46.51,88.74 47.23,88.03
U9P-LX2
  pour Top (no thermals): 48.74,88.03 48.74,93.19 50.01,93.19 50.01,88.74 49.29,88.03
U9P-SW
  Top 0.508: U9-P.5 56.09,73.34 L1-9P.1
V_LDO_IN
  Top 0.152: 43.5,83.82 42.86,84.45
  Top 0.254: 46.72,83.82 43.5,83.82
  Top 0.508: D1-11P.1 64.12,50.8 64.12,53.01 C1-11P.1
  Top 1.778: 41.06,85.09 42.23,85.09 42.86,84.45 42.86,66.36 58.42,50.8 R1-11P.2 64.12,50.8 | D1-11P.1 64.12,53.01
  pour Top (no thermals): 45.72,83.82 46.53,84.63 46.53,87.71 45.85,88.39 33.78,88.39 31.62,86.23 31.62,84.2 32,83.82
VBAT
  Top 0.508: C2-1P.1 U1-P.3 | 84.8,34.64 R5-11P.1 | 84.77,33.05 84.8,33.02
  Top 1.27: S1-P.P 84.8,30.19 84.8,33.02 | 84.8,36.54 84.8,35.56 84.8,34.64 | R5-11P.1 84.77,33.05
  Top 1.778: C2-1P.1 79.69,41.65 84.8,36.54 | 84.8,35.56 84.8,37.49 88.27,40.96 91.34,40.96 93.19,39.12 93.19,38.19 1S_LIPO.1
  pour Top (no thermals): 79.25,61.21 78.99,61.47 78.99,62.99 79.38,63.37 79.38,65.79 80.01,65.79 80.52,65.28 80.52,61.72 80.01,61.21
  pour Top (no thermals): 84.77,30.16 84.77,37.47 88.27,40.96 90.81,40.96 92.39,39.37 88.9,39.37 88.9,33.02 82.55,26.67 81.28,26.67
  pour Top (no thermals): 84.45,36.83 79.69,41.59 79.69,52.7 91.44,40.96 87.31,36.83
VBAT_AFTER_ARMING  (5 unrouted)
  Top 0.152: P-CHANNEL_MOSFET1.2 P-CHANNEL_MOSFET1.1 | P-CHANNEL_MOSFET1.5 P-CHANNEL_MOSFET1.6
VBAT_AFTER_SWITCH  (4 unrouted)
  Top 0.508: D1-11P.2 66.99,50.8 68.58,50.8 R4-11P.1
  Top 1.27: 10.16,33.02 10.26,33.02
  Top 1.778: S1-P.S 81.28,33.02 | 81.28,33.02 81.28,34.61 | 81.28,34.61 68.58,47.31 68.58,50.8 | 81.28,34.61 R5-11P.2 | 10.26,33.02 81.28,33.02
  pour Top (no thermals): 66.99,38.89 66.99,51.75 68.1,52.86 69.06,52.86 69.06,46.83 81.28,34.61 81.28,29.21 78.9,29.21
  pour Top (no thermals): 6.67,33.02 6.67,19.37 20.32,33.02
  pour Top (no thermals): 17.78,30.48 78.74,30.48 70.48,38.73 66.99,38.73 61.28,33.02 17.78,33.02
VUSB  (via drill 0.35)
  Top 0.508: 76.2,72.39 79.38,72.39 80.33,71.44 C1-1P.1
  Top 1.27: 80.33,71.44 80.33,72.23 v80.17,72.39
  Top 1.778: D1-1P.A 73.66,71.12 74.93,72.39 76.2,72.39 v80.17,72.39
  Bottom 1.778: JP-CP.4 72.53,86.36 80.17,78.72 v80.17,72.39
  pour Top (no thermals): 79.38,66.29 80.01,66.29 81.03,67.31 81.03,72.83 80.69,73.17 79.38,73.17

### Text on the board
tPlace: HDD | HDD off | Arming | Armed
tNames: 1 | 2 | 3 | 4 | D1 | D2 | D3 | D4 | B | B | M1 | M2 | M3 | M4 | MBATISTICH JKAJI MPARAL | BYPASS SWITCH | POWER | Purdue Space Program Solids SRAD PSD Prototype 1.0
bNames: MBATISTICH JKAJI MPARAL | Purdue Space Program Solids SRAD PSD Prototype 1.0